# EAGLE design code-red (EAGLE 7.7.0)
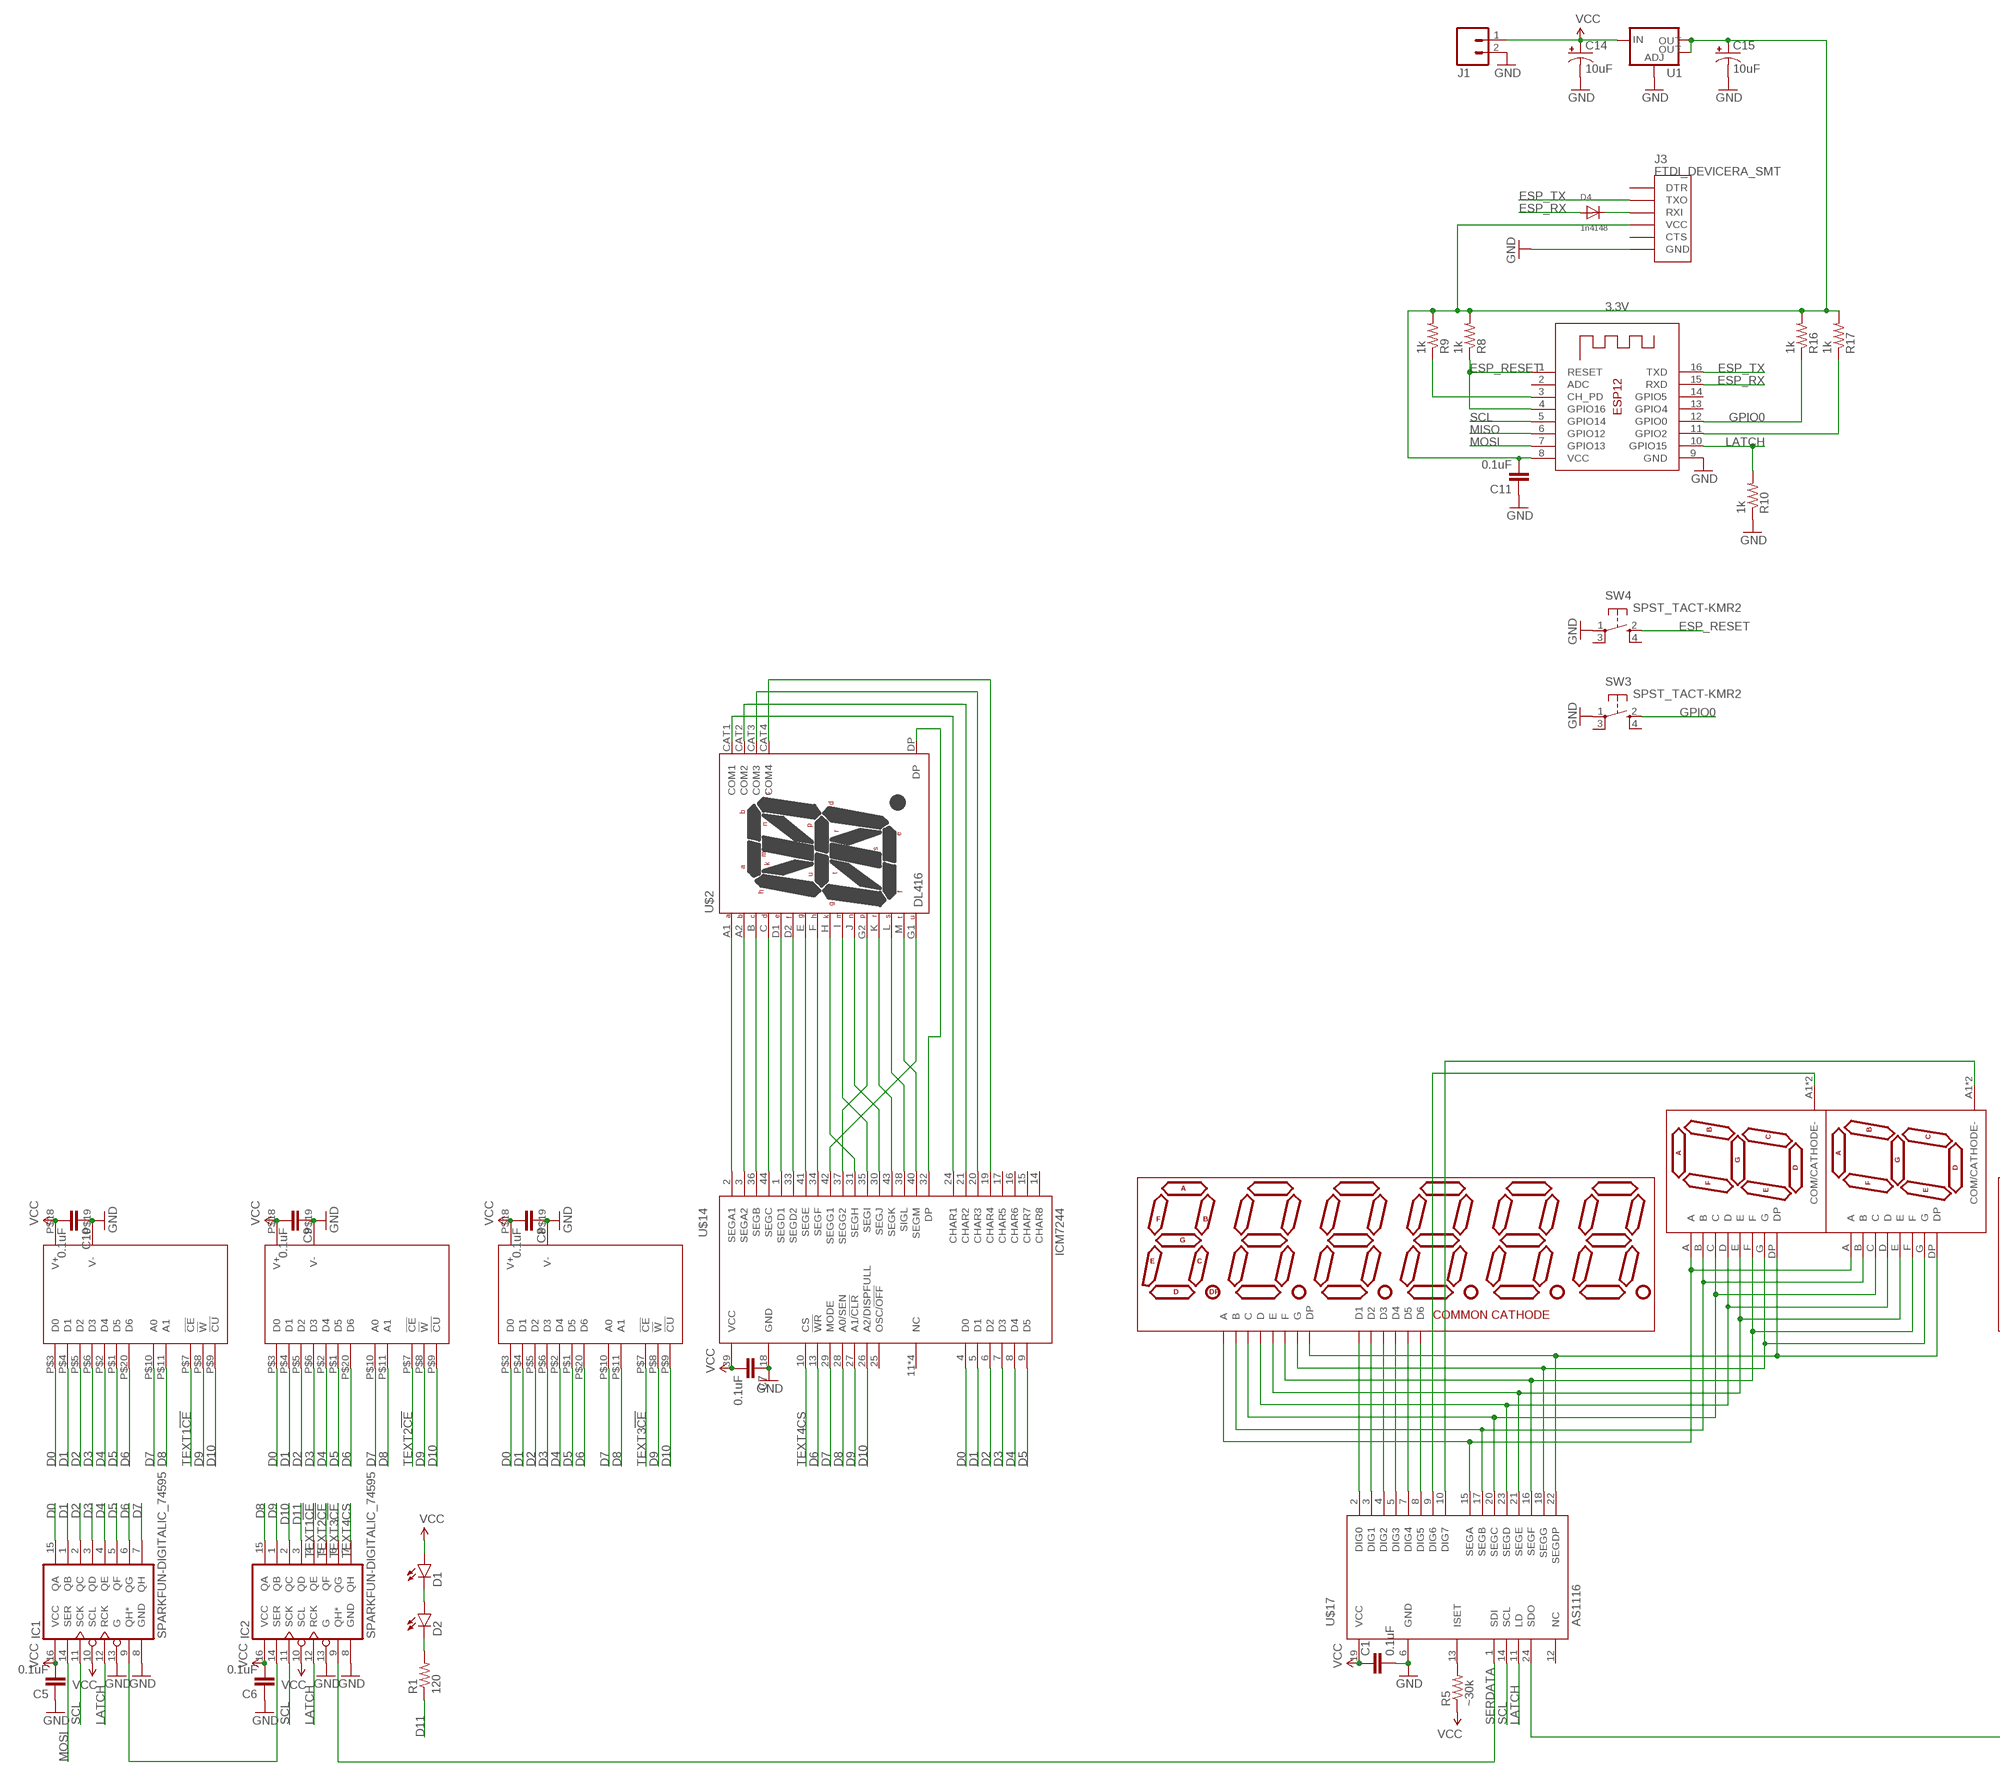
[diagram p0: schematic, sheet 1, part 1 of 2]
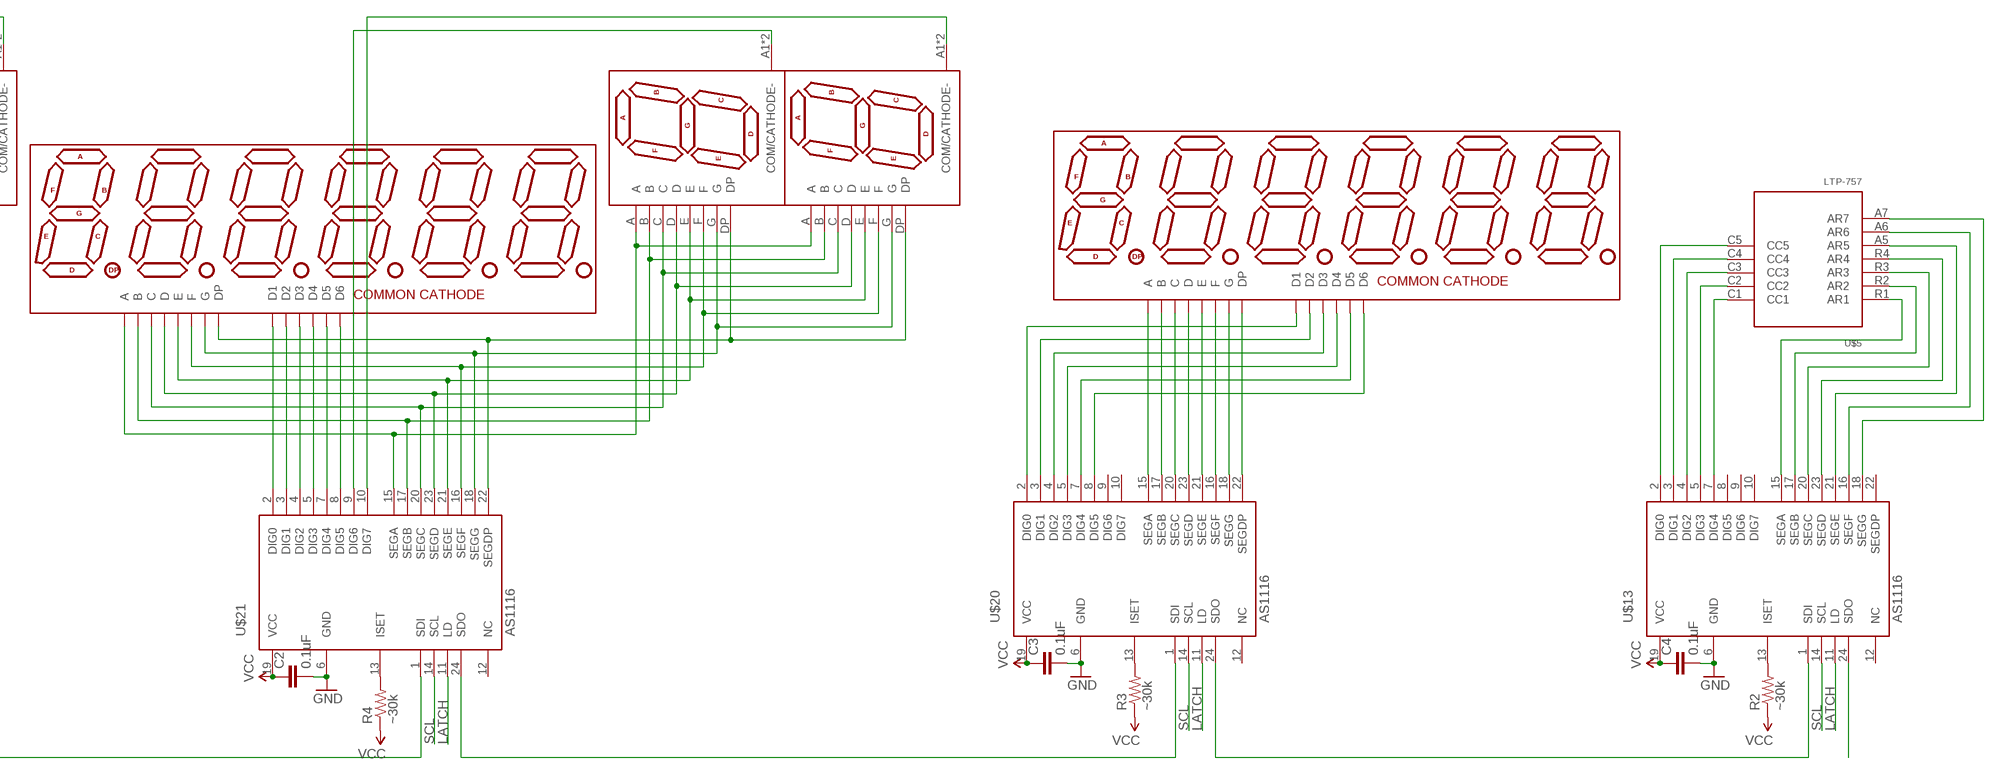
[diagram p1: schematic, sheet 1, part 2 of 2]

## Parts
C1  0.1uF  CAP0805  [0805]
C2  0.1uF  CAP0805  [0805]
C3  0.1uF  CAP0805  [0805]
C4  0.1uF  CAP0805  [0805]
C5  0.1uF  CAP0805  [0805]
C6  0.1uF  CAP0805  [0805]
C7  0.1uF  CAP0805  [0805]
C8  0.1uF  CAP0805  [0805]
C9  0.1uF  CAP0805  [0805]
C10  0.1uF  CAP0805  [0805]
C11  0.1uF  CAP0805  [0805]
C14  10uF  CAP_POLD  [PANASONIC_D]
C15  10uF  CAP_POLD  [PANASONIC_D]
D1  LED3MM  [LED3MM]
D2  LED3MM  [LED3MM]
D4  1n4148  DIODESOD-123  [SOD-123]
IC1  SPARKFUN-DIGITALIC_74595  [SPARKFUN-DIGITALIC_TSSOP16]
IC2  SPARKFUN-DIGITALIC_74595  [SPARKFUN-DIGITALIC_TSSOP16]
J1  M02LOCK_LONGPADS  [1X02_LOCK_LONGPADS]
J3  FTDI_DEVICERA_SMT  [FTDI_DEVICE_RA_SMT]
R1  120  RESISTOR0805-RES  [0805]
R2  ~30k  RESISTOR0805-RES  [0805]
R3  ~30k  RESISTOR0805-RES  [0805]
R4  ~30k  RESISTOR0805-RES  [0805]
R5  ~30k  RESISTOR0805-RES  [0805]
R8  1k  RESISTOR0805-RES  [0805]
R9  1k  RESISTOR0805-RES  [0805]
R10  1k  RESISTOR0805-RES  [0805]
R16  1k  RESISTOR0805-RES  [0805]
R17  1k  RESISTOR0805-RES  [0805]
SW3  SPST_TACT-KMR2  [KMR2]
SW4  SPST_TACT-KMR2  [KMR2]
U1  V_REG_LM1117SOT223  [SOT223]
U$1  DIS1291  [DIS1291]
U$2  DL416  [DL416]
U$3  DL1416T  [DL1416T]
U$4  FND259  [FND359]
U$5  LTP-757  [LTP-757]
U$6  DIS1291  [DIS1291]
U$7  DIS1291  [DIS1291]
U$8  DL1416T  [DL1416T]
U$9  DL1416T  [DL1416T]
U$10  FND259  [FND359]
U$11  FND259  [FND359]
U$12  FND259  [FND359]
U$13  AS1116  [SSOP24]
U$14  ICM7244  [MQFP44-2]
U$17  AS1116  [SSOP24]
U$20  AS1116  [SSOP24]
U$21  AS1116  [SSOP24]
X1  ESP-12  [ESP-12]

## Nets
3.3V: C11.2 C15.+ J3.4(VCC) R8.2 R9.2 R16.2 R17.2 U1.2(OUT) U1.4(OUT) X1.8(VCC)
D0: IC1.15(QA) U$3.P$3(D0) U$8.P$3(D0) U$9.P$3(D0) U$14.4(D0)
D1: IC1.1(QB) U$3.P$4(D1) U$8.P$4(D1) U$9.P$4(D1) U$14.5(D1)
D2: IC1.2(QC) U$3.P$5(D2) U$8.P$5(D2) U$9.P$5(D2) U$14.6(D2)
D3: IC1.3(QD) U$3.P$6(D3) U$8.P$6(D3) U$9.P$6(D3) U$14.7(D3)
D4: IC1.4(QE) U$3.P$2(D4) U$8.P$2(D4) U$9.P$2(D4) U$14.8(D4)
D5: IC1.5(QF) U$3.P$1(D5) U$8.P$1(D5) U$9.P$1(D5) U$14.9(D5)
D6: IC1.6(QG) U$3.P$20(D6) U$8.P$20(D6) U$9.P$20(D6) U$14.13(!WR)
D7: IC1.7(QH) U$3.P$10(A0) U$8.P$10(A0) U$9.P$10(A0) U$14.29(MODE)
D8: IC2.15(QA) U$3.P$11(A1) U$8.P$11(A1) U$9.P$11(A1) U$14.28(A0/SEN)
D9: IC2.1(QB) U$3.P$8(!W) U$8.P$8(!W) U$9.P$8(!W) U$14.27(A1/!CLR)
D10: IC2.2(QC) U$3.P$9(!CU) U$8.P$9(!CU) U$9.P$9(!CU) U$14.26(A2/DISPFULL)
D11: IC2.3(QD) R1.1
ESP_RESET: R8.1 SW4.2(S) X1.1(RESET) X1.4(GPIO16)
ESP_RX: D4.A X1.15(RXD)
ESP_TX: J3.2(TXO) X1.16(TXD)
GND: C1.2 C2.2 C3.2 C4.2 C5.1 C6.1 C7.1 C8.1 C9.1 C10.1 C11.1 C14.- C15.- IC1.8(GND) IC1.13(G) IC2.8(GND) IC2.13(G) J1.2 J3.6(GND) R10.1 SW3.1(P) SW4.1(P) U1.1(ADJ) U$3.P$19(V-) U$8.P$19(V-) U$9.P$19(V-) U$13.6(GND) U$14.18(GND) U$17.6(GND) U$20.6(GND) U$21.6(GND) X1.9(GND)
GPIO0: R16.1 SW3.2(S) X1.12(GPIO0)
LATCH: IC1.12(RCK) IC2.12(RCK) R10.2 U$13.11(LD) U$17.11(LD) U$20.11(LD) U$21.11(LD) X1.10(GPIO15)
MISO: X1.6(GPIO12)
MOSI: IC1.14(SER) X1.7(GPIO13)
N$1: U$1.P$12(A) U$4.A U$10.A U$17.15(SEGA)
N$2: U$1.P$16(F) U$4.F U$10.F U$17.16(SEGF)
N$3: U$1.P$15(B) U$4.B U$10.B U$17.17(SEGB)
N$4: U$1.P$9(G) U$4.G U$10.G U$17.18(SEGG)
N$5: U$1.P$1(C) U$4.C U$10.C U$17.20(SEGC)
N$6: U$1.P$7(E) U$4.E U$10.E U$17.21(SEGE)
N$7: U$1.P$8(DP) U$4.DP U$10.DP U$17.22(SEGDP)
N$8: U$1.P$4(D) U$4.D U$10.D U$17.23(SEGD)
N$9: U$1.P$14(D1) U$17.2(DIG0)
N$10: U$1.P$3(D2) U$17.3(DIG1)
N$11: U$1.P$13(D3) U$17.4(DIG2)
N$12: U$1.P$5(D4) U$17.5(DIG3)
N$13: U$1.P$11(D5) U$17.7(DIG4)
N$14: U$1.P$6(D6) U$17.8(DIG5)
N$15: U$6.P$12(A) U$11.A U$12.A U$21.15(SEGA)
N$16: U$6.P$16(F) U$11.F U$12.F U$21.16(SEGF)
N$17: U$6.P$15(B) U$11.B U$12.B U$21.17(SEGB)
N$18: U$6.P$9(G) U$11.G U$12.G U$21.18(SEGG)
N$19: U$6.P$1(C) U$11.C U$12.C U$21.20(SEGC)
N$20: U$6.P$7(E) U$11.E U$12.E U$21.21(SEGE)
N$21: U$6.P$8(DP) U$11.DP U$12.DP U$21.22(SEGDP)
N$22: U$6.P$4(D) U$11.D U$12.D U$21.23(SEGD)
N$23: U$6.P$14(D1) U$21.2(DIG0)
N$24: U$6.P$3(D2) U$21.3(DIG1)
N$25: U$6.P$13(D3) U$21.4(DIG2)
N$26: U$6.P$5(D4) U$21.5(DIG3)
N$27: U$6.P$11(D5) U$21.7(DIG4)
N$28: U$6.P$6(D6) U$21.8(DIG5)
N$29: U$7.P$12(A) U$20.15(SEGA)
N$30: U$7.P$16(F) U$20.16(SEGF)
N$31: U$7.P$15(B) U$20.17(SEGB)
N$32: U$7.P$9(G) U$20.18(SEGG)
N$33: U$7.P$1(C) U$20.20(SEGC)
N$34: U$7.P$7(E) U$20.21(SEGE)
N$35: U$7.P$8(DP) U$20.22(SEGDP)
N$36: U$7.P$4(D) U$20.23(SEGD)
N$37: U$7.P$14(D1) U$20.2(DIG0)
N$38: U$7.P$3(D2) U$20.3(DIG1)
N$39: U$7.P$13(D3) U$20.4(DIG2)
N$40: U$7.P$5(D4) U$20.5(DIG3)
N$41: U$7.P$11(D5) U$20.7(DIG4)
N$42: U$7.P$6(D6) U$20.8(DIG5)
N$43: U$2.G1(U) U$14.42(SEGG1)
N$44: R2.2 U$13.13(ISET)
N$45: R3.2 U$20.13(ISET)
N$46: R4.2 U$21.13(ISET)
N$47: R5.2 U$17.13(ISET)
N$48: IC1.9(QH*) IC2.14(SER)
N$49: U$2.CAT1(COM1) U$14.24(CHAR1)
N$51: U$13.1(SDI) U$20.24(SDO)
N$52: D1.K(C) D2.A
N$53: D2.K(C) R1.2
N$54: U$2.A1(A) U$14.2(SEGA1)
N$55: U$5.C1(CC1) U$13.7(DIG4)
N$56: U$5.C2(CC2) U$13.5(DIG3)
N$57: U$5.C3(CC3) U$13.4(DIG2)
N$58: U$5.C4(CC4) U$13.3(DIG1)
N$59: U$5.C5(CC5) U$13.2(DIG0)
N$60: U$5.R1(AR1) U$13.15(SEGA)
N$61: U$5.R2(AR2) U$13.17(SEGB)
N$62: U$5.R3(AR3) U$13.20(SEGC)
N$63: U$5.R4(AR4) U$13.23(SEGD)
N$64: U$5.A5(AR5) U$13.21(SEGE)
N$65: U$5.A6(AR6) U$13.16(SEGF)
N$66: U$5.A7(AR7) U$13.18(SEGG)
N$67: U$2.B(C1) U$14.36(SEGB)
N$68: U$2.C(D) U$14.44(SEGC)
N$69: U$20.1(SDI) U$21.24(SDO)
N$70: U$2.CAT2(COM2) U$14.21(CHAR2)
N$71: U$2.CAT3(COM3) U$14.20(CHAR3)
N$72: U$2.CAT4(COM4) U$14.19(CHAR4)
N$73: U$17.24(SDO) U$21.1(SDI)
N$75: U$13.24(SDO)
N$77: U$2.A2(B1) U$14.3(SEGA2)
N$78: U$2.D2(F1) U$14.33(SEGD2)
N$79: U$2.E(G) U$14.41(SEGE)
N$80: U$2.F(H1) U$14.34(SEGF)
N$81: U$2.H(K1) U$14.31(SEGH)
N$82: U$2.I(M1) U$14.35(SEGI)
N$83: U$2.J(N) U$14.30(SEGJ)
N$84: U$2.K(R) U$14.43(SEGK)
N$85: U$2.L(S) U$14.38(SIGL)
N$86: U$2.M(T) U$14.40(SEGM)
N$87: U$2.D1(E1) U$14.1(SEGD1)
N$88: U$2.DP U$14.32(DP)
N$89: U$2.G2(P) U$14.37(SEGG2)
N$90: U$4.A1(COM/CATHODE-) U$4.A2(COM/CATHODE-) U$17.9(DIG6)
N$91: U$10.A1(COM/CATHODE-) U$10.A2(COM/CATHODE-) U$17.10(DIG7)
N$92: U$11.A1(COM/CATHODE-) U$11.A2(COM/CATHODE-) U$21.9(DIG6)
N$93: U$12.A1(COM/CATHODE-) U$12.A2(COM/CATHODE-) U$21.10(DIG7)
N$94: R9.1 X1.3(CH_PD)
N$98: D4.C J3.3(RXI)
N$99: R17.1 X1.11(GPIO2)
SCL: IC1.11(SCK) IC2.11(SCK) U$13.14(SCL) U$17.14(SCL) U$20.14(SCL) U$21.14(SCL) X1.5(GPIO14)
SERDATA: IC2.9(QH*) U$17.1(SDI)
TEXT1!CE: IC2.4(QE) U$3.P$7(!CE)
TEXT2!CE: IC2.5(QF) U$8.P$7(!CE)
TEXT3!CE: IC2.6(QG) U$9.P$7(!CE)
TEXT4CS: IC2.7(QH) U$14.10(CS)
VCC: C1.1 C2.1 C3.1 C4.1 C5.2 C6.2 C7.2 C8.2 C9.2 C10.2 C14.+ D1.A IC1.10(SCL) IC1.16(VCC) IC2.10(SCL) IC2.16(VCC) J1.1 R2.1 R3.1 R4.1 R5.1 U1.3(IN) U$3.P$18(V+) U$8.P$18(V+) U$9.P$18(V+) U$13.19(VCC) U$14.39(VCC) U$17.19(VCC) U$20.19(VCC) U$21.19(VCC)
Unconnected: J3.1(DTR) J3.5(CTS) SW3.3(P1) SW3.4(S1) SW4.3(P1) SW4.4(S1) U$13.8(DIG5) U$13.9(DIG6) U$13.10(DIG7) U$13.12(NC) U$13.22(SEGDP) U$14.11(NC) U$14.12(NC) U$14.14(CHAR8) U$14.15(CHAR7) U$14.16(CHAR6) U$14.17(CHAR5) U$14.22(NC) U$14.23(NC) U$14.25(OSC/!OFF) U$17.12(NC) U$20.9(DIG6) U$20.10(DIG7) U$20.12(NC) U$21.12(NC) X1.2(ADC) X1.13(GPIO4) X1.14(GPIO5)

## Library data of the parts
C1-C11 = SparkFun-Capacitors:CAP: Capacitor Standard 0603 ceramic capacitor, and 0.1" leaded capacitor.
C14 C15 = SparkFun-Capacitors:CAP_POL: Capacitor Polarized These are standard SMD and PTH capacitors. Normally 10uF, 47uF, and 100uF in electrolytic and tantalum varieties. Always verify the external diameter of the through hole cap, it varies with capacity, voltage, and manufacturer. The EIA devices should be standard.
D1 D2 = SparkFun-LED:LED: LEDs Standard schematic elements and footprints for 5mm, 3mm, 1206, and 0603 sized LEDs. 5mm - Spark Fun Electronics SKU : COM-00529 (and others); PROD_ID: DIO-08794
D4 = adafruit:DIODE: Diode SMADIODE - SMA Surface Mount Package 20V 1A Schottky Diode Digikey: 641-1014-6-ND DO-1N4148 - Through Hole Small Current Diode SOD-123 20V 1 A (.5mV Vf) Schottky Diode - Digikey: MBRX120TPMSCT-ND SOD-323 10V 570mA (.38mV Vf, 3ns) Schottky Diode - Digikey: ZLLS410CT-ND SOD-523 30V 30mA Schottky Diode (RB751S-40TE61) - Digikey: RB751S-40TE61CT-ND SOT23-R/W - SOT23 Package (R = Solder Paste/Reflow Ovens, W = Hand-Soldering) BAT54Film 40V 300mA - Digikey: 497-7162-1-ND
IC1 IC2 = TimeCircuits:SPARKFUN-DIGITALIC_74*595: 8-bit SHIFT REGISTER, output latch
J1 = SparkFun-Connectors:M02: Standard 2-pin 0.1" header. Use with - straight break away headers ( PRT-00116) - right angle break away headers (PRT-00553) - swiss pins (PRT-00743) - machine pins (PRT-00117) - female headers (PRT-00115) Molex polarized connector foot print use with: PRT-08233 with associated crimp pins and housings. 2.54_SCREWTERM for use with PRT-10571. 3.5mm Screw Terminal footprints for PRT-08084 5mm Screw Terminal footprints for use with PRT-08432
J3 = SparkFun-Connectors:FTDI_DEVICE: Connector which mates to FTDI basic or FTDI cable.; PROD_ID: CONN-08971
R1-R5 R8-R10 R16 R17 = SparkFun-Resistors:RESISTOR: Resistor Basic schematic elements and footprints for 0603, 1206, and PTH resistors.
SW3 SW4 = adafruit:SPST_TACT: SMT 6mm switch, EVQQ2 series http://www.ladyada.net/library/eagle
U1 = SparkFun-PowerIC:V_REG_LM1117: Voltage Regulator LM1117 Standard adjustable voltage regulator but in SMD form. Spark Fun Electronics SKU : COM-00595; PROD_ID: VREG-08170
U$1 U$6 U$7 = sonik:DIS1291
U$2 = sonik:DL416
U$3 U$8 U$9 = sonik:DL1416T
U$4 U$10-U$12 = sonik:FND259
U$5 = sonik:LTP-757
U$13 U$17 U$20 U$21 = sonik:AS1116
U$14 = sonik:ICM7244
X1 = adafruit:ESP-12

## Net classes
2 power: width 0.203 mm

## Board
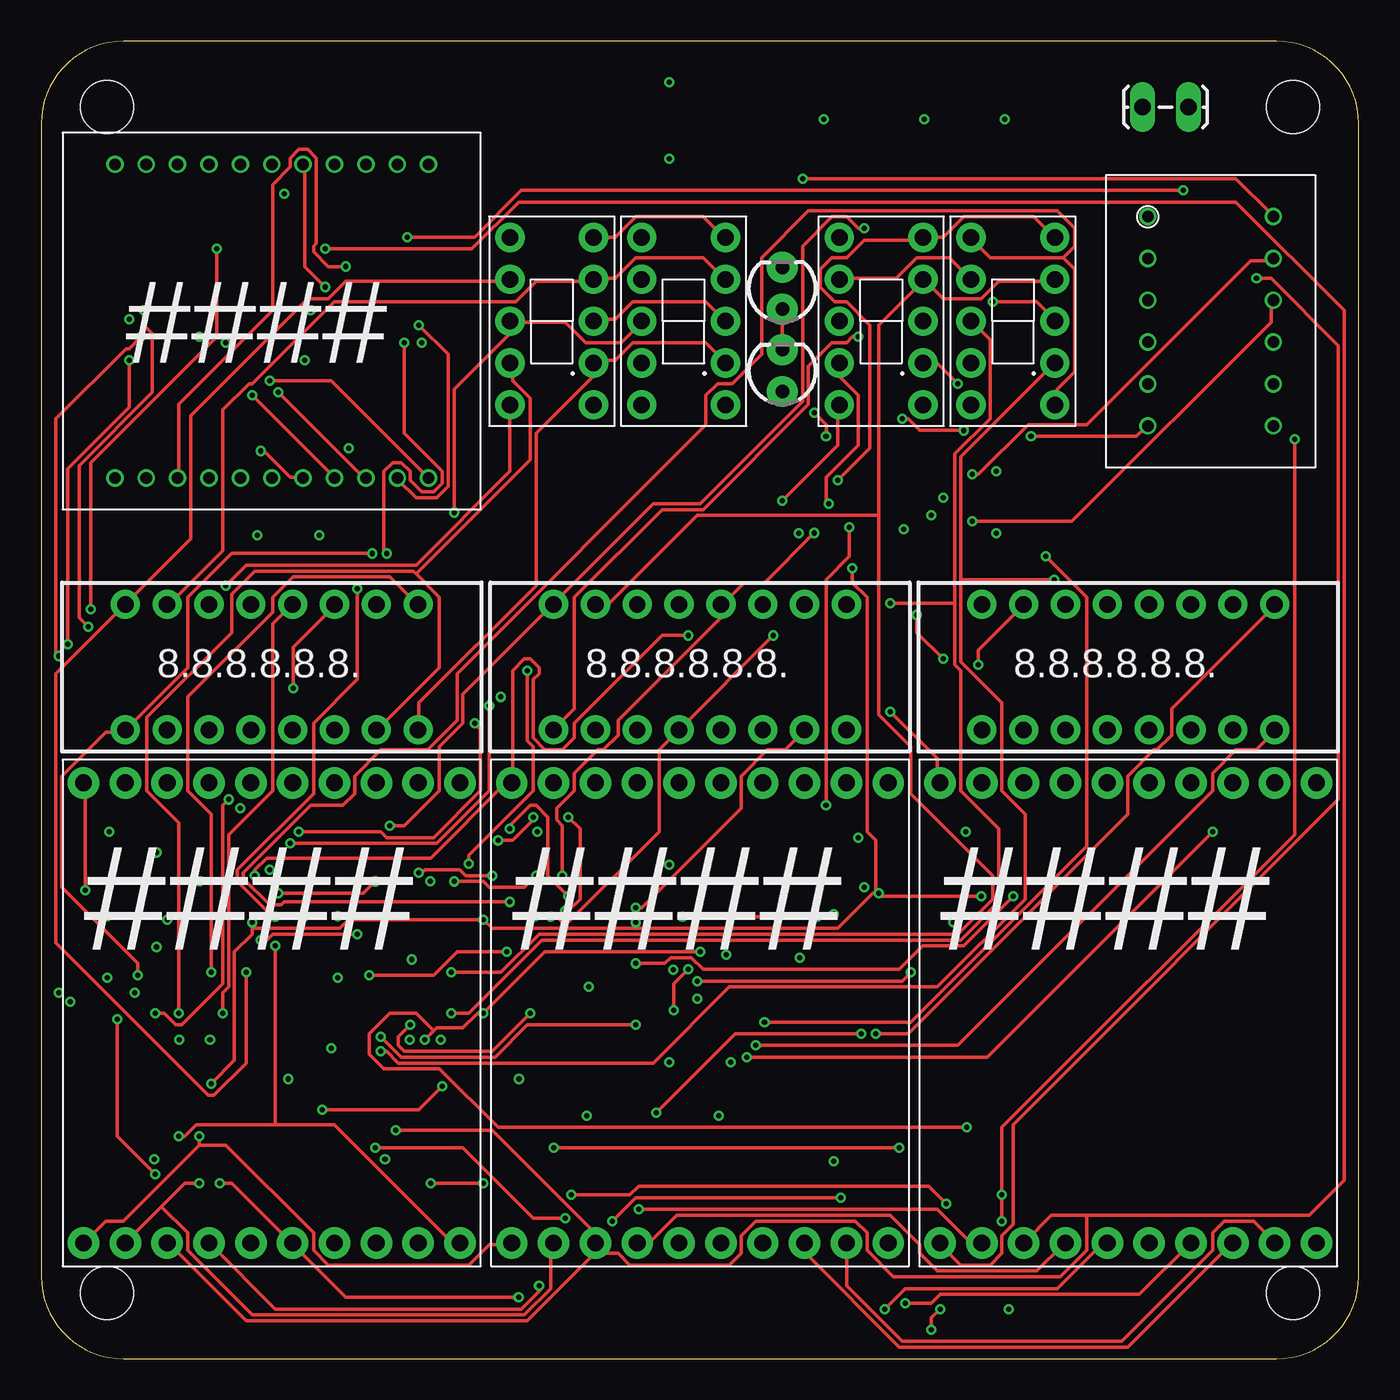
[diagram p2: board, top side]
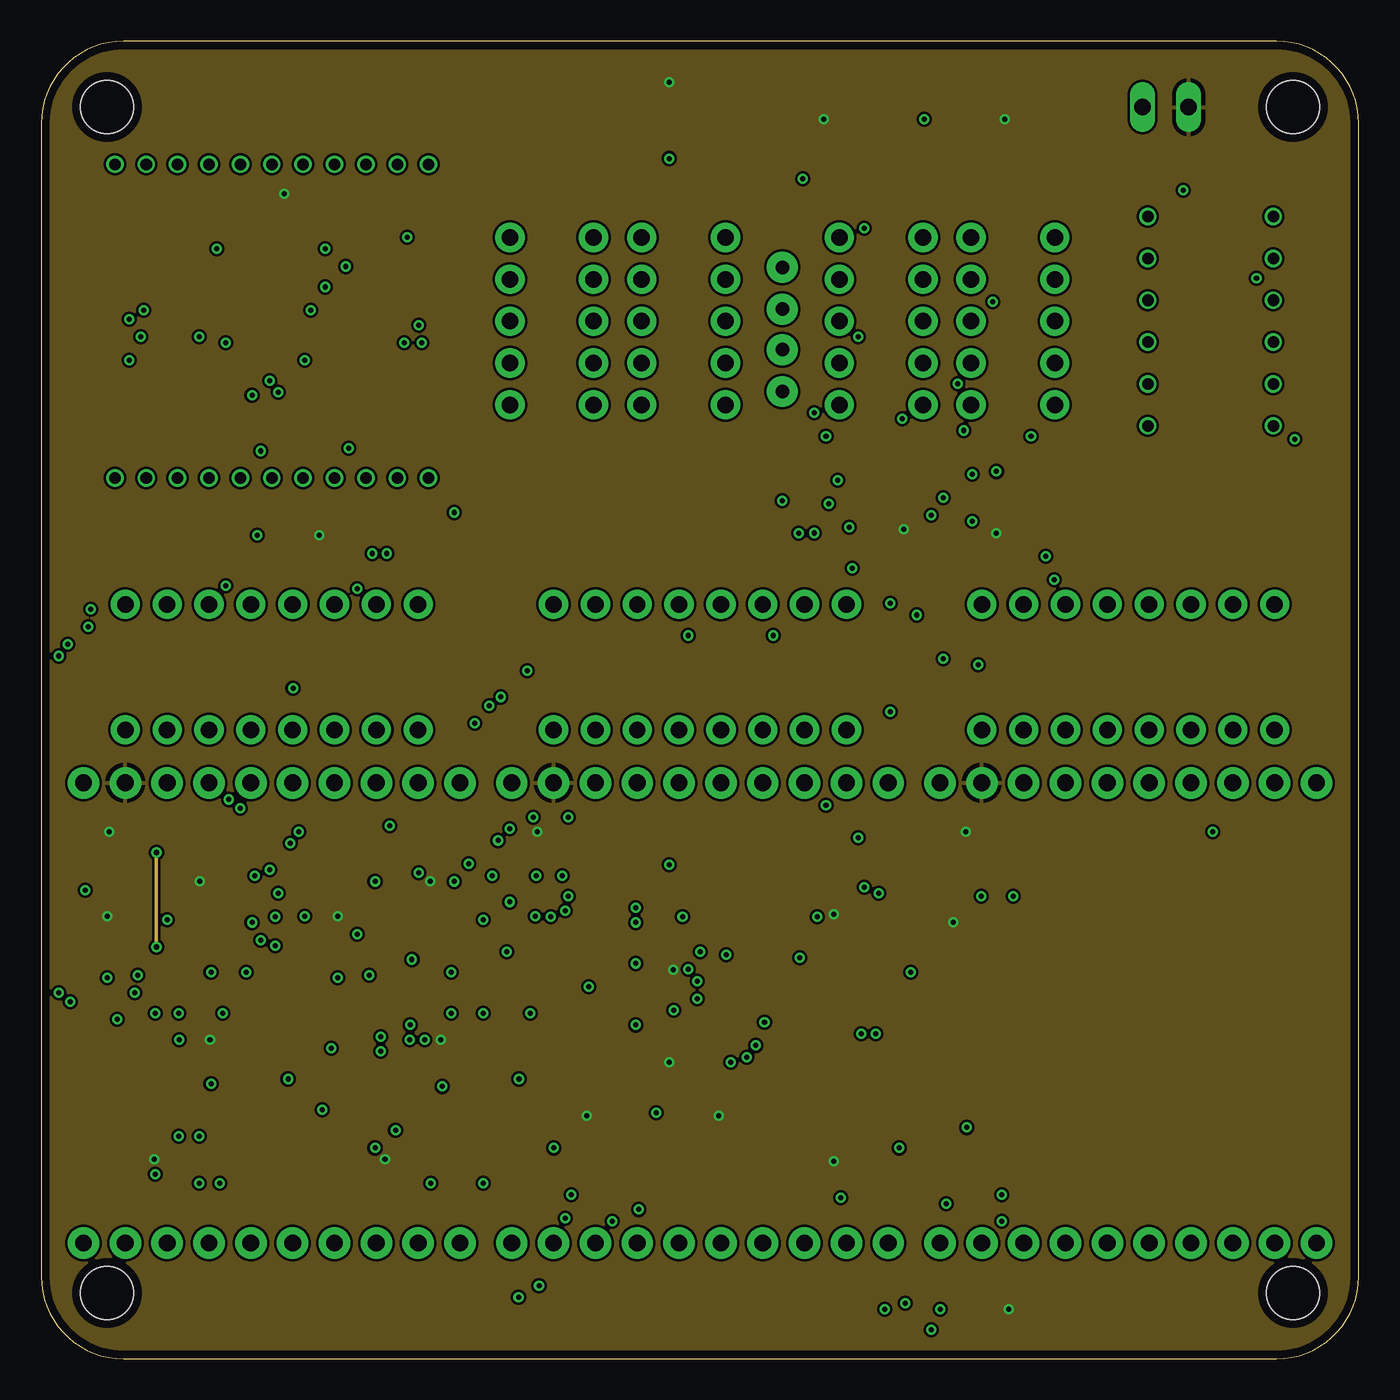
[diagram p3: board, inner layer Route2]
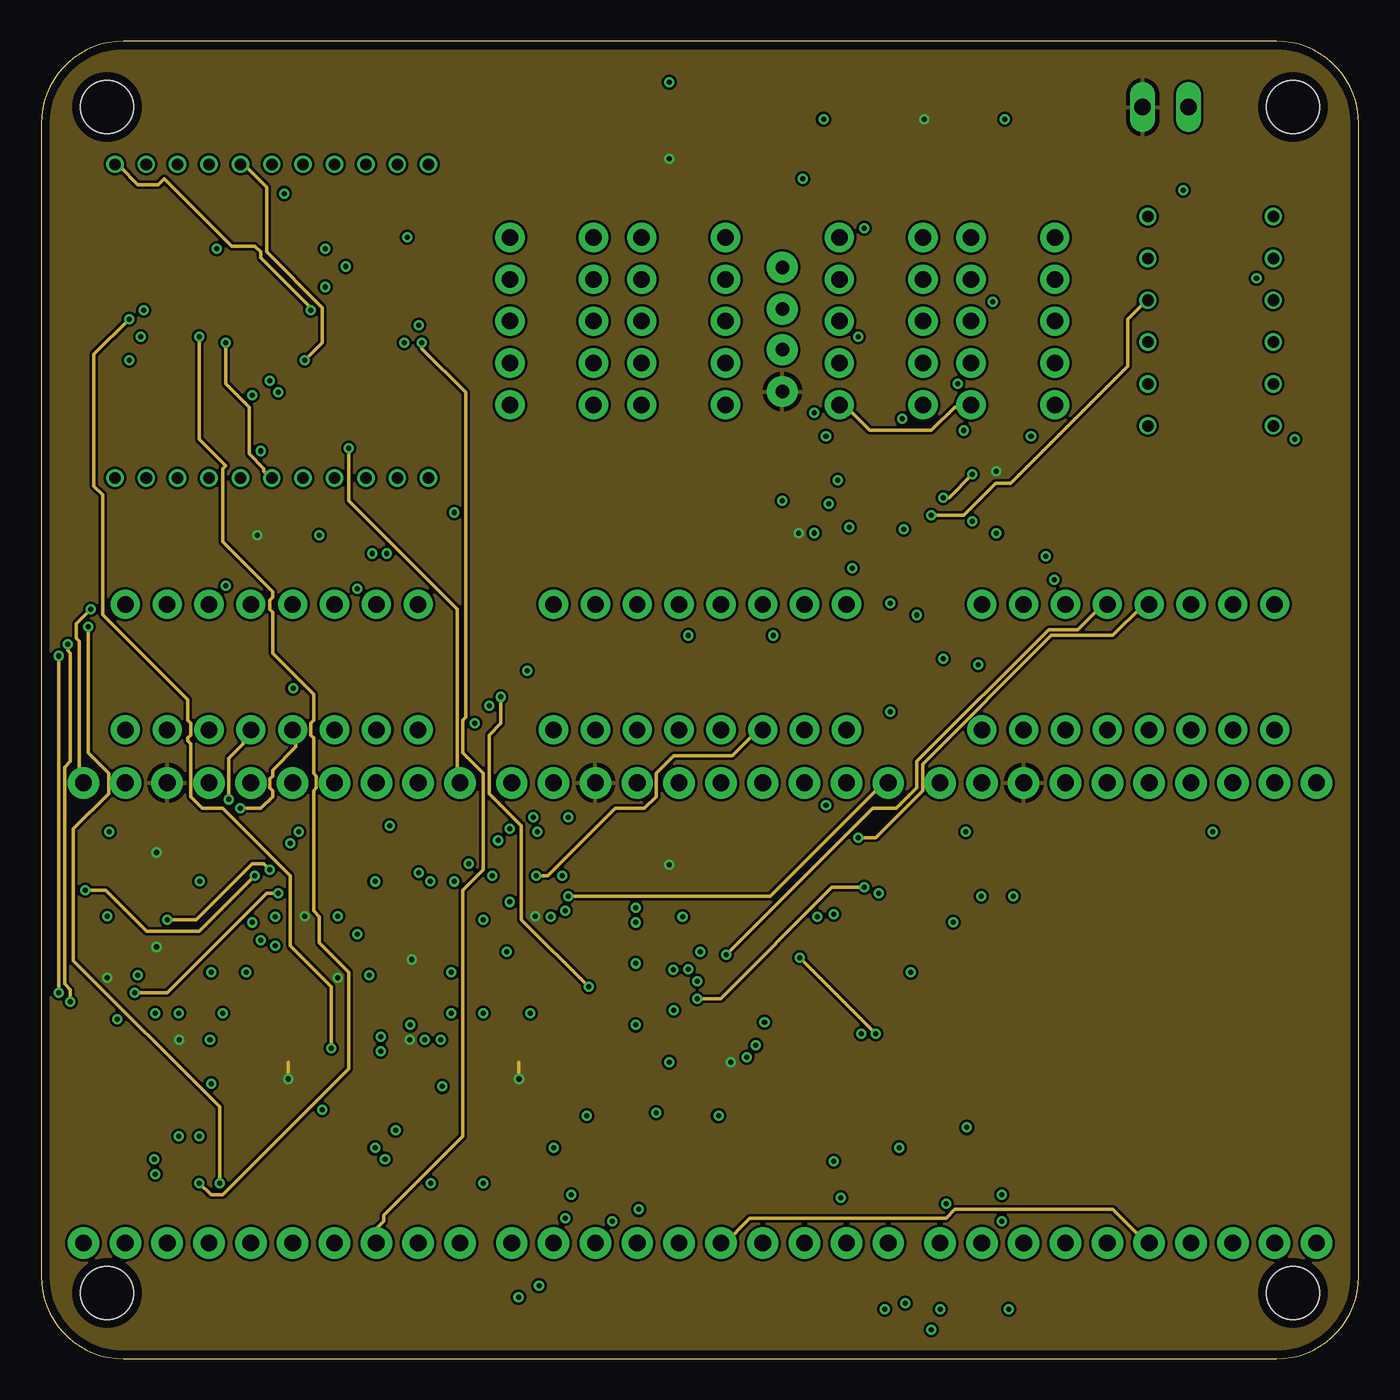
[diagram p4: board, inner layer Route15]
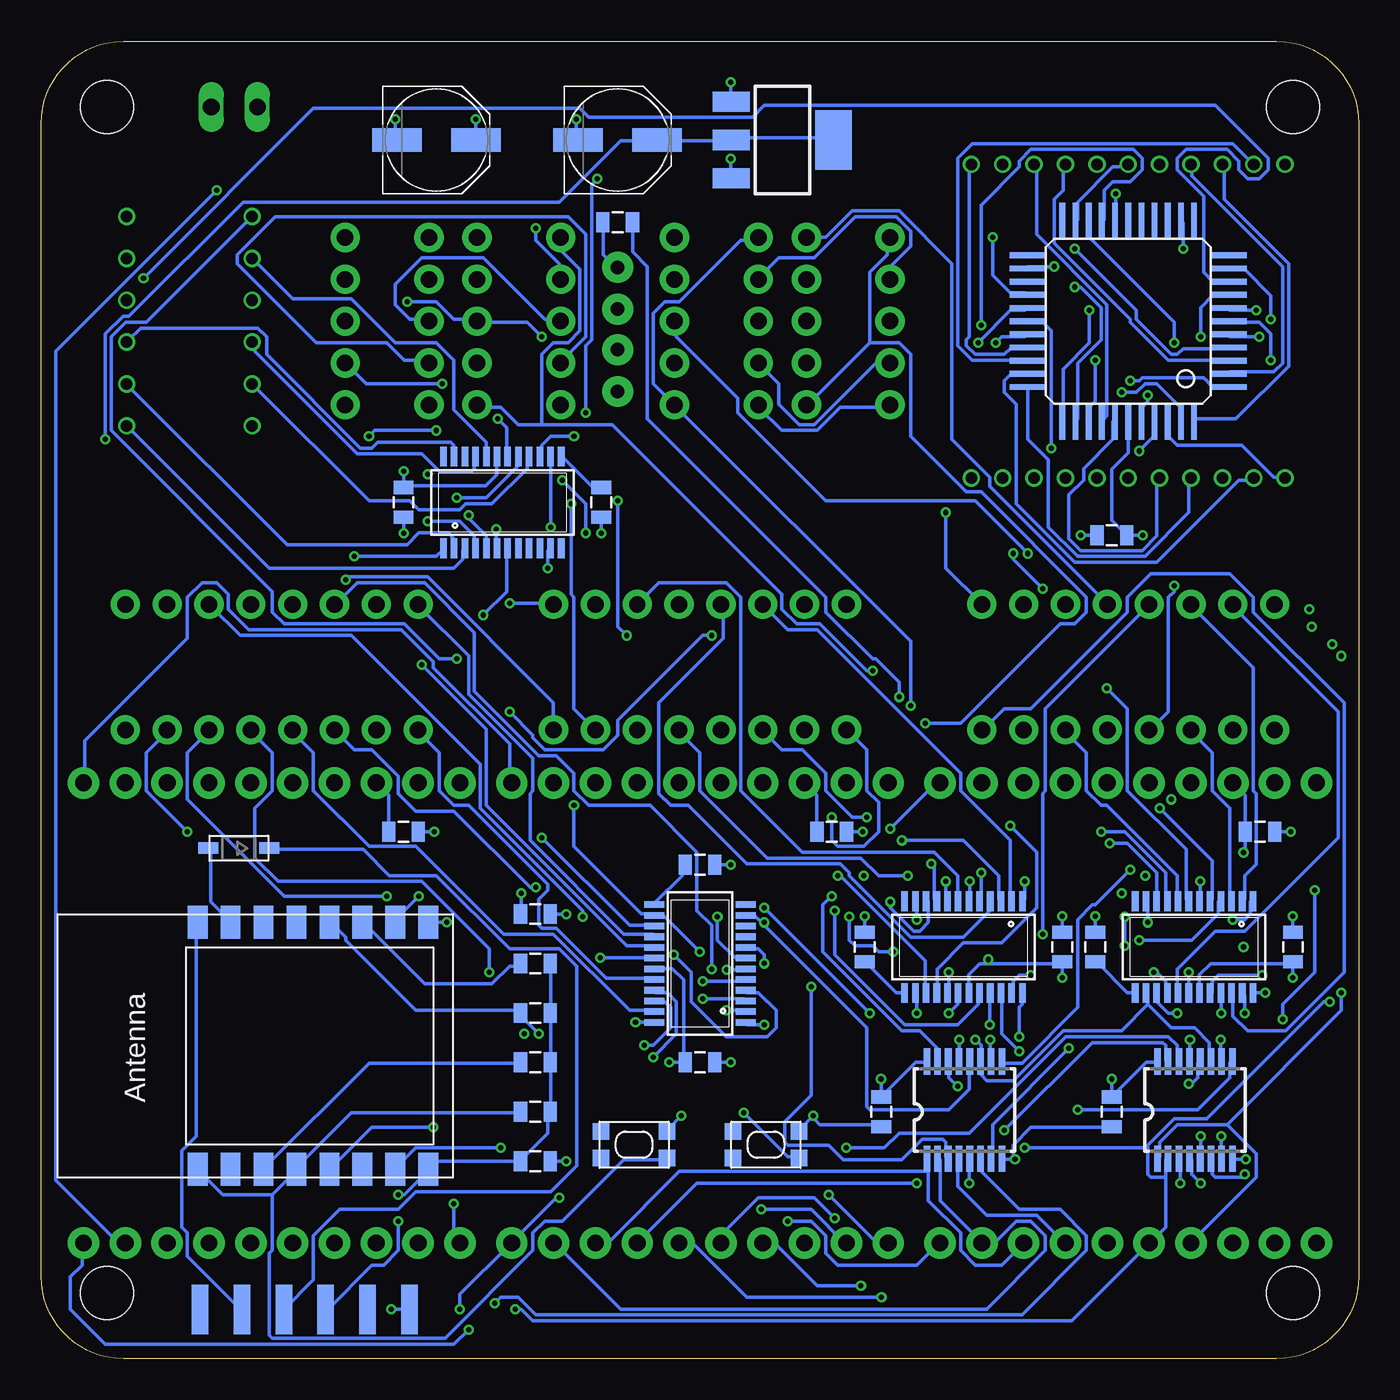
[diagram p5: board, bottom side, seen from below]

Size 80 x 80 mm. Coordinates in mm from the lower left corner, seen from the top.
Outline: 0,75 0,5 arc90 5,0 75,0 arc90 80,5 80,75 arc90 75,80 5,80 arc90 0,75
Copper layers (1*2*15*16): Top 0.035mm / dielectric 0.23mm / Route2 0.035mm / dielectric 0.93mm / Route15 0.035mm / dielectric 0.23mm / Bottom 0.035mm
Design rules "MF_Standard_4_Layer *": minimum track width 8mil, minimum drill 12mil, track to track 6mil, track to pad 6mil, pad to pad 6mil, via to via 8mil, smd to smd 0mil, copper to edge 20mil, drill to drill 10mil, minimum pad ring 6mil, minimum via ring 6mil, stop-mask expansion 2mil, vias tented up to drill 25mil, thermal gap 10mil
Holes 3.2 mm at 4,4 76,4 76,76 4,76

### Footprints (pad centres in the part's own frame; a part is rotated, then mirrored left to right if it is on the bottom)
0805 = smd 0.8 x 1.2: 1 -0.9,0; 2 0.9,0
PANASONIC_D = smd 3 x 1.4: + 2.4,0; - -2.4,0
LED3MM = drill 0.813 pad 1.88: A -1.27,0; K 1.27,0
SOD-123 = smd 1.2 x 0.7: A 1.85,0; C -1.85,0
SPARKFUN-DIGITALIC_TSSOP16 = smd 0.4 x 1.6: 1 -2.225,-2.85; 2 -1.575,-2.85; 3 -0.925,-2.85; 4 -0.275,-2.85; 5 0.375,-2.85; 6 1.025,-2.85; 7 1.675,-2.85; 8 2.325,-2.85; 9 2.325,3.05; 10 1.675,3.05; 11 1.025,3.05; 12 0.375,3.05; 13 -0.275,3.05; 14 -0.925,3.05; 15 -1.575,3.05; 16 -2.225,3.05
1X02_LOCK_LONGPADS = drill 1.016 long: 1 -0.127,0; 2 2.667,0
FTDI_DEVICE_RA_SMT = smd 1 x 3: 1 -6.35,5; 2 -3.81,5; 3 -1.27,5; 4 1.27,5; 5 3.81,5; 6 6.35,5
KMR2 = smd 1 x 1: 1 2,0.8; 2 2,-0.8; 3 -2,0.8; 4 -2,-0.8
SOT223 = smd 1.219 x 2.235: 1 -2.311,-3.099; 2 0,-3.099; 3 2.311,-3.099 | smd 3.6 x 2.2: 4 0,3.099
DIS1291 = drill 1 pad 1.778: P$1 -8.89,-3.81; P$2 -6.35,-3.81; P$3 -3.81,-3.81; P$4 -1.27,-3.81; P$5 1.27,-3.81; P$6 3.81,-3.81; P$7 6.35,-3.81; P$8 8.89,-3.81; P$9 8.89,3.81; P$10 6.35,3.81; P$11 3.81,3.81; P$12 1.27,3.81; P$13 -1.27,3.81; P$14 -3.81,3.81; P$15 -6.35,3.81; P$16 -8.89,3.81
DL416 = drill 0.7: A1 -3.81,9.525; A2 3.81,9.525; B -1.905,9.525; C -5.715,9.525; CAT1 -5.715,-9.525; CAT2 0,9.525; CAT3 0,-9.525; CAT4 7.62,-9.525; D1 9.525,-9.525; D2 -3.81,-9.525; DP -7.62,-9.525; E 1.905,-9.525; F -9.525,9.525; G1 -9.525,-9.525; G2 5.715,9.525; H -7.62,9.525; I 1.905,9.525; J 9.525,9.525; K 5.715,-9.525; L -1.905,-9.525; M 3.81,-9.525; NC 7.62,9.525
DL1416T = drill 1.016 pad 1.905: P$1 -11.43,-13.97; P$2 -8.89,-13.97; P$3 -6.35,-13.97; P$4 -3.81,-13.97; P$5 -1.27,-13.97; P$6 1.27,-13.97; P$7 3.81,-13.97; P$8 6.35,-13.97; P$9 8.89,-13.97; P$10 11.43,-13.97; P$11 11.43,13.97; P$12 8.89,13.97; P$13 6.35,13.97; P$14 3.81,13.97; P$15 1.27,13.97; P$16 -1.27,13.97; P$17 -3.81,13.97; P$18 -6.35,13.97; P$19 -8.89,13.97; P$20 -11.43,13.97
FND359 = drill 1 pad 1.778: A 2.54,5.08; A1 -2.54,5.08; A2 2.54,-5.08; B 2.54,2.54; C 2.54,0; D -2.54,-5.08; DP 2.54,-2.54; E -2.54,-2.54; F -2.54,2.54; G -2.54,0
LTP-757 = drill 0.7: A5 -3.81,-1.27; A6 -3.81,-3.81; A7 -3.81,-6.35; C1 -3.81,6.35; C2 -3.81,1.27; C3 3.81,1.27; C4 3.81,-6.35; C5 3.81,-3.81; R1 3.81,6.35; R2 3.81,3.81; R3 -3.81,3.81; R4 3.81,-1.27
SSOP24 = smd 0.4 x 1.2: 1 -3.575,-2.785; 2 -2.925,-2.785; 3 -2.275,-2.785; 4 -1.625,-2.785; 5 -0.975,-2.785; 6 -0.325,-2.785; 7 0.325,-2.785; 8 0.975,-2.785; 9 1.625,-2.785; 10 2.275,-2.785; 11 2.925,-2.785; 12 3.575,-2.785; 13 3.575,2.785; 14 2.925,2.785; 15 2.275,2.785; 16 1.625,2.785; 17 0.975,2.785; 18 0.325,2.785; 19 -0.325,2.785; 20 -0.975,2.785; 21 -1.625,2.785; 22 -2.275,2.785; 23 -2.925,2.785; 24 -3.575,2.785
MQFP44-2 = smd 0.35 x 2.2: 1 -4,-6.1; 2 -3.2,-6.1; 3 -2.4,-6.1; 4 -1.6,-6.1; 5 -0.8,-6.1; 6 0,-6.1; 7 0.8,-6.1; 8 1.6,-6.1; 9 2.4,-6.1; 10 3.2,-6.1; 11 4,-6.1; 23 4,6.1; 24 3.2,6.1; 25 2.4,6.1; 26 1.6,6.1; 27 0.8,6.1; 28 0,6.1; 29 -0.8,6.1; 30 -1.6,6.1; 31 -2.4,6.1; 32 -3.2,6.1; 33 -4,6.1 | smd 2.2 x 0.35: 12 6.1,-4; 13 6.1,-3.2; 14 6.1,-2.4; 15 6.1,-1.6; 16 6.1,-0.8; 17 6.1,0; 18 6.1,0.8; 19 6.1,1.6; 20 6.1,2.4; 21 6.1,3.2; 22 6.1,4; 34 -6.1,4; 35 -6.1,3.2; 36 -6.1,2.4; 37 -6.1,1.6; 38 -6.1,0.8; 39 -6.1,0; 40 -6.1,-0.8; 41 -6.1,-1.6; 42 -6.1,-2.4; 43 -6.1,-3.2; 44 -6.1,-4
ESP-12 = smd 2 x 1.2: 1 -7.5,4.5; 2 -7.5,2.5; 3 -7.5,0.5; 4 -7.5,-1.5; 5 -7.5,-3.5; 6 -7.5,-5.5; 7 -7.5,-7.5; 8 -7.5,-9.5; 9 7.5,-9.5; 10 7.5,-7.5; 11 7.5,-5.5; 12 7.5,-3.5; 13 7.5,-1.5; 14 7.5,0.5; 15 7.5,2.5; 16 7.5,4.5

### Placement (x,y rotation side)
C1  4,25 90 bottom
C2  18,25 90 bottom
C3  40,18 0 bottom
C4  29,15 270 bottom
C5  15,15 90 bottom
C6  58,52 90 bottom
C7  15,50 0 bottom
C8  6,32 180 bottom
C9  32,32 180 bottom
C10  58,32 180 bottom
C11  50,12 180 bottom
C14  56,74 0 bottom
C15  45,74 0 bottom
D1  45,60 90 top
D2  45,65 90 top
D4  68,31 180 bottom
IC1  10,15 0 bottom
IC2  24,15 0 bottom
J1  67,76 0 top
J3  64,-2 0 bottom
R1  45,69 180 bottom
R2  46,52 90 bottom
R3  40,30 180 bottom
R4  30,25 270 bottom
R5  16,25 270 bottom
R8  50,15 0 bottom
R9  50,18 0 bottom
R10  50,27 180 bottom
R16  50,21 0 bottom
R17  50,24 0 bottom
SW3  36,13 0 bottom
SW4  44,13 0 bottom
U1  35,74 270 bottom
U$1  14,42 0 top
U$2  14,63 0 top
U$3  14,21 0 top
U$4  31,63 0 top
U$5  71,63 0 top
U$6  40,42 0 top
U$7  66,42 0 top
U$8  40,21 0 top
U$9  66,21 0 top
U$10  39,63 0 top
U$11  51,63 0 top
U$12  59,63 0 top
U$13  52,52 0 bottom
U$14  14,63 90 bottom
U$17  10,25 180 bottom
U$20  40,24 90 bottom
U$21  24,25 180 bottom
X1  66,19 90 bottom

### Tracks (layer width: path | path; a pad name or v marks a point on that pad's centre or on a via)
3.3V  (via drill 0.3)
  Top 0.203: v58.32,8.36 v58.32,9.96 58.32,14.05 76.1,31.83 v76.1,55.83
  Bottom 0.203: U1.4 32,74.14 38.05,74.14 U1.2 38.23,73.97 42.49,73.97 C15.+ 42.67,73.97 44.81,73.97 48.54,70.23 67.74,70.23 74.68,63.3 75.03,63.3 76.1,62.23 v76.1,55.83 | R17.2 49.07,23.82 49.07,21.16 R16.2 49.07,20.98 49.07,18.14 R9.2 49.07,17.96 49.07,15.11 R8.2 49.25,14.94 49.25,13.69 50.85,12.09 C11.2 56,12 X1.8 56.54,11.38 57.96,9.96 v58.32,9.96 | v58.32,8.36 58.32,6.58 59.21,5.69 59.92,5.69 62.59,3.02 J3.4
D0  (via drill 0.3)
  Top 0.203: v21.51,13.87 27.38,13.87 33.6,7.64 33.6,7.11 U$8.P$3 | 33.6,6.4 29.52,2.31 12.45,2.31 7.82,6.93 U$3.P$3 | 33.6,6.4 33.6,6.93 U$8.P$3 | v17.25,67.39 26.14,67.39 28.98,70.23 72.54,70.23 79.12,63.65 79.12,10.85 76.99,8.71 63.48,8.71 | 63.48,8.71 61.34,8.71 59.74,7.11 U$9.P$3 | 33.6,6.4 35.03,6.4 35.74,5.69 41.78,5.69 42.49,6.4 42.49,7.47 43.38,8.36 49.43,8.36 50.14,7.64 50.14,6.58 51.74,4.98 61.87,4.98 63.48,6.58 63.48,8.71 | 33.6,6.4 U$8.P$3
  Bottom 0.203: v21.51,13.87 16.18,19.2 11.91,19.2 11.73,19.02 11.73,18.14 IC1.15 | v17.25,67.39 13.51,63.65 13.51,63.12 11.38,60.98 11.02,60.98 10.67,61.34 8,61.34 U$14.4
D1  (via drill 0.3)
  Top 0.203: U$8.P$4 36.27,7.11 36.98,7.11 38.58,8.71 51.56,8.71 53.34,6.93 53.34,6.4 54.41,5.33 60.45,5.33 62.05,6.93 U$9.P$4 | v6.04,62.05 5.33,61.34 5.16,61.34 0.89,57.07 0.89,42.85 v1.07,42.67 | v30.23,4.45 30.23,4.09 29.16,3.02 14.22,3.02 10.31,6.93 U$3.P$4
  Route15 0.203: v1.07,22.23 v1.07,42.67
  Bottom 0.203: 8,14.22 11.02,14.22 12.09,13.16 12.09,12.27 IC1.1 | 8,14.22 6.22,12.45 6.22,11.02 10.13,7.11 U$3.P$4 | v6.04,62.05 7.82,62.05 U$14.5 | v1.07,22.23 1.07,21.16 8,14.22 | v30.23,4.45 32.89,4.45 35.38,6.93 36.09,6.93 U$8.P$4
D2  (via drill 0.3)
  Top 0.203: v5.33,60.63 5.33,57.78 1.6,54.05 v1.6,43.38 | v31.83,8.53 29.87,8.53 25.6,12.8 v20.27,12.8 | v51.21,3.02 52.45,4.27 61.7,4.27 64.36,6.93 64.72,6.93 U$9.P$5
  Route15 0.203: v1.6,43.38 1.6,43.03 1.78,42.85 1.78,36.27 1.42,35.92 1.42,22.76 1.78,22.4 v1.78,21.69
  Bottom 0.203: 11.73,11.02 11.73,8 12.62,7.11 U$3.P$5 12.8,6.93 17.42,2.31 50.14,2.31 50.85,3.02 v51.21,3.02 | 11.73,11.02 11.73,12.09 IC1.2 | v5.33,60.63 5.33,62.23 6.04,62.94 7.82,62.94 U$14.6 | v1.78,21.69 2.13,21.69 9.25,14.58 11.2,14.58 12.8,12.98 12.8,12.8 | 12.8,12.8 12.8,11.2 12.62,11.02 11.73,11.02 | v31.83,8.53 33.07,9.78 36.45,9.78 38.58,7.64 38.58,7.11 U$8.P$5 | 12.8,12.8 v20.27,12.8
D3  (via drill 0.3)
  Top 0.203: v10.85,10.67 11.56,10.67 15.11,7.11 U$3.P$6 15.29,6.93 18.49,3.73 v28.98,3.73 | v6.22,63.65 6.22,62.76 6.76,62.23 6.76,58.67 2.31,54.23 2.31,44.98 v2.85,44.45
  Route15 0.203: v2.85,44.45 2.85,36.8 4.09,35.56 4.09,34.31 1.96,32.18 1.96,24.18 10.85,15.29 v10.85,10.67 | U$9.P$6 67.21,7.11 66.85,7.47 66.67,7.47 65.08,9.07 55.47,9.07 54.94,8.53 43.03,8.53 41.43,6.93 U$8.P$6
  Bottom 0.203: v10.85,10.67 10.85,12.09 IC1.3 | v6.22,63.65 7.82,63.65 U$14.7 | v28.98,3.73 37.16,3.73 40.36,6.93 41.25,6.93 U$8.P$6
D4  (via drill 0.3)
  Top 0.203: v9.6,10.67 8.71,10.67 7.29,9.25 | 7.29,9.25 5.16,7.11 U$3.P$2 | 7.29,9.25 8.89,7.64 8.89,6.58 12.8,2.67 29.34,2.67 30.94,4.27 30.94,6.93 U$8.P$2 | v36.27,9.07 54.41,9.07 56.36,7.11 57.07,7.11 U$9.P$2
  Route15 0.203: v9.6,62.05 9.6,55.83 11.2,54.23 11.02,54.05 11.02,49.61 14.05,46.58 14.05,46.23 13.87,46.05 13.87,45.52 14.05,45.34 14.05,42.85 16.54,40.36 16.54,38.76 16.36,38.58 16.36,37.87 16.54,37.69 16.54,35.56 16.71,35.38 16.71,34.67 16.54,34.49 16.54,27.2 16.89,26.85 16.89,25.25 18.67,23.47 18.67,17.6 11.02,9.96 10.31,9.96 v9.6,10.67
  Bottom 0.203: v9.6,10.67 10.13,11.2 10.13,12.09 IC1.4 | v9.6,62.05 9.6,63.83 8.89,64.54 8,64.54 U$14.8 | v36.27,9.07 33.25,9.07 31.11,6.93 U$8.P$2
D5  (via drill 0.3)
  Top 0.203: 9.6,12.98 v9.6,13.51 | 9.6,12.98 4.98,8.36 3.91,8.36 2.67,7.11 U$3.P$1 | 9.6,12.98 11.2,12.98 16.54,7.64 16.54,6.58 17.42,5.69 25.96,5.69 27.2,6.93 28.45,6.93 U$8.P$1 | v73.79,65.61 74.68,65.61 78.77,61.52 78.77,33.96 59.03,14.22 59.03,8.18 58.32,7.47 58.32,6.4 57.61,5.69 55.83,5.69 54.59,6.93 U$9.P$1 | v32.18,9.96 35.74,9.96 36.27,10.49 53.87,10.49 v54.94,9.42
  Bottom 0.203: v9.6,13.51 9.6,12.27 IC1.5 | v73.79,65.61 63.48,75.92 47.3,75.92 46.76,75.39 36.8,75.39 36.09,76.1 8.71,76.1 5.51,72.9 5.51,72.19 6.04,71.65 6.76,71.65 7.29,72.19 7.29,72.72 8,73.43 10.49,73.43 11.02,72.9 11.02,72.19 9.42,70.59 9.42,65.96 8.89,65.43 8,65.43 U$14.9 | v32.18,9.96 29.34,7.11 28.63,7.11 U$8.P$1 | v54.94,9.42 54.94,7.47 54.59,7.11 U$9.P$1
D6  (via drill 0.3)
  Top 0.203: v6.93,11.2 4.62,13.51 v4.62,20.62 | v2.67,28.45 2.67,34.85 U$3.P$20 | v10.67,67.39 10.67,62.05 3.02,54.41 v3.02,45.52 | v12.98,29.34 12.98,29.69 13.69,30.4 23.65,30.4 28.09,34.85 28.45,34.85 U$8.P$20 28.63,35.03 28.63,41.78 29.34,42.49 29.69,42.49 30.23,41.96 30.23,41.6 29.87,41.25 29.87,37.69 30.58,36.98 31.65,36.98 32.36,37.69 32.36,38.58 37.69,43.92 v39.29,43.92 | v51.56,39.29 54.41,36.45 54.41,35.03 U$9.P$20
  Route15 0.203: v3.02,45.52 2.13,44.63 2.13,43.74 2.31,43.56 2.31,35.92 2.49,35.74 2.49,35.03 U$3.P$20 | v12.98,29.34 9.6,25.96 6.4,25.96 3.91,28.45 v2.67,28.45
  Bottom 0.203: v6.93,11.2 7.11,11.02 8.71,11.02 8.89,11.2 8.89,12.09 IC1.6 | v4.62,20.62 4.62,21.51 2.67,23.47 v2.67,28.45 | v10.67,67.39 10.67,68.99 U$14.13 | v51.56,39.29 50.14,37.87 50.14,37.69 49.43,36.98 45.87,36.98 44.98,37.87 44.98,38.76 39.83,43.92 v39.29,43.92
D7  (via drill 0.3)
  Top 0.203: v8.36,13.51 8.71,13.51 9.42,14.22 14.22,14.22 | 14.22,14.22 17.78,14.22 24.89,7.11 25.43,7.11 U$3.P$10 | v22.05,61.7 22.05,56.19 24.36,53.87 24.36,53.16 23.82,52.63 23.11,52.63 22.4,53.34 22.4,53.87 21.87,54.41 21.34,54.41 20.8,53.87 20.8,49.07 v20.98,48.9 | v19.2,46.76 19.2,41.25 16.54,38.58 16.54,34.31 11.91,29.69 11.91,28.98 14.05,26.85 v14.22,26.85 | 14.22,14.22 v14.22,25.07 | v48.54,9.78 36.09,9.78 v34.67,8.36 | v54.05,1.78 54.05,2.49 v54.59,3.02
  Bottom 0.203: v8.36,13.51 8.36,12.27 IC1.7 | v22.05,61.7 21.69,62.05 20.27,62.05 U$14.29 | v20.98,48.9 20.98,48.54 v19.2,46.76 | v14.22,25.07 v14.22,26.85 | v48.54,9.78 48.72,9.78 51.38,7.11 U$8.P$10 51.56,6.93 54.59,3.91 v54.59,3.02 | v34.67,8.36 33.25,8.36 32.36,7.47 32.36,6.4 31.65,5.69 26.85,5.69 25.6,6.93 U$3.P$10 | v54.05,1.78 54.94,0.89 76.1,0.89 78.23,3.02 78.23,4.98 77.52,5.69 77.52,6.93 U$9.P$10
D8  (via drill 0.3)
  Top 0.203: v32,28.09 30.76,29.34 30.76,32.89 30.05,33.6 29.69,33.6 28.45,32.36 v28.45,32.18
  Route15 0.203: v18.67,55.3 18.67,52.09 25.25,45.52 25.25,35.2 25.43,35.03 U$3.P$11 | v32,28.09 44.27,28.09 51.03,34.85 51.38,34.85 U$8.P$11
  Bottom 0.203: U$8.P$11 51.56,35.03 51.56,37.34 56.19,41.96 56.19,42.32 58.14,44.27 67.39,44.27 68.63,45.52 68.63,46.41 69.34,47.12 70.23,47.12 71.12,46.23 71.12,43.74 77.34,37.52 77.34,35.03 U$9.P$11 | v32,28.09 32.54,27.56 32.54,24.71 27.74,19.91 26.67,19.91 25.6,18.85 25.6,18.14 IC2.15 | v28.45,32.18 25.6,35.03 U$3.P$11 | v18.67,55.3 18.67,62.41 19.2,62.94 20.09,62.94 U$14.28
D9  (via drill 0.3)
  Top 0.203: U$9.P$8 72.19,6.93 65.96,0.71 52.09,0.71 46.41,6.4 46.41,6.93 U$8.P$8
  Route15 0.203: v23.11,61.7 23.11,61.34 25.78,58.67 25.78,38.94 25.6,38.76 25.6,36.8 26.85,35.56 26.85,29.69 25.6,28.45 25.6,13.51 20.8,8.71 20.8,8.36 20.45,8 20.45,7.11 U$3.P$8
  Bottom 0.203: 26.14,11.38 26.14,9.6 24.18,7.64 24.18,6.58 23.29,5.69 21.69,5.69 20.45,6.93 U$3.P$8 | 26.14,11.38 26.14,12.09 IC2.1 26.14,11.38 | v23.11,61.7 21.16,63.65 20.27,63.65 U$14.27 | 26.14,11.38 41.25,11.38 45.52,7.11 46.23,7.11 U$8.P$8
D10  (via drill 0.3)
  Top 0.203: v22.23,68.1 26.31,68.1 29.16,70.94 v69.34,70.94 | U$8.P$9 48.9,6.93 48.9,4.45 52.27,1.07 65.61,1.07 71.12,6.58 71.12,7.64 71.83,8.36 73.61,8.36 74.85,7.11 U$9.P$9
  Bottom 0.203: IC2.2 25.43,12.09 25.43,9.6 22.94,7.11 U$3.P$9 22.76,7.11 22.05,7.11 20.8,8.36 19.91,8.36 19.02,7.47 19.02,6.58 22.58,3.02 44.81,3.02 48.72,6.93 U$8.P$9 | v22.23,68.1 22.23,65.79 21.16,64.72 20.27,64.72 U$14.26 | v69.34,70.94 79.12,61.16 79.12,10.85 75.39,7.11 75.03,7.11 U$9.P$9
D11  (via drill 0.3)
  Route15 0.203: v27.91,40.18 27.91,38.58 27.2,37.87 27.2,34.31 29.16,32.36 29.16,26.67 v33.25,22.58
  Bottom 0.203: v27.91,40.18 27.91,41.07 29.34,42.49 29.52,42.49 32.36,45.34 32.36,46.23 43.2,57.07 43.2,66.32 44.09,67.21 44.09,68.99 R1.1 | v33.25,22.58 33.25,16 34.85,14.4 34.85,13.16 34.67,12.98 32.18,12.98 31.29,12.09 27.74,12.09 26.49,13.34 25.25,13.34 25.07,13.16 25.07,12.27 IC2.3
ESP_RESET
  Bottom 0.203: 65.96,9.96 65.96,6.58 66.14,6.4 66.14,1.42 65.96,1.25 55.47,1.25 50.14,6.58 50.14,7.64 49.43,8.36 48.36,8.36 44.63,12.09 42.14,12.09 SW4.2 | 65.96,9.96 64.54,11.38 X1.4 64.54,11.56 61.16,14.94 51.03,14.94 R8.1 | 65.96,9.96 68.99,9.96 70.41,11.38 X1.1
ESP_RX
  Bottom 0.203: D4.A 69.7,30.94 69.7,27.74 68.63,26.67 X1.15
ESP_TX
  Bottom 0.203: X1.16 70.59,26.49 70.59,13.51 71.48,12.62 71.48,8 71.12,7.64 71.12,6.22 67.92,3.02 J3.2
GND  (via drill 0.3)
  Bottom 0.203: 29,14.12 C4.2 29.16,14.22 32.72,14.22 33.07,14.58 v33.12,14.75 34,13.88 SW3.1 | 15,14.12 C5.1 15.11,14.05 19.91,14.05 20.98,12.98 20.98,12.27 v20.88,12.12 21.62,12.12 IC2.8 | v41.12,14.75 42,13.88 SW4.1 | v4,26.88 C1.2 | v9.62,29 9.62,27.88 U$17.6 | v4.12,32 C8.1 | v18,26.88 C2.2 | v23.62,29 23.62,27.88 U$21.6 | v38.12,18 C3.2 | v48.12,12 C11.1 | v38.38,23.62 37.25,23.62 U$20.6 | v30.12,32 C9.1 | v16.88,50 C7.1 | v48.12,27 R10.1 | v56.12,32 C10.1 | v52.38,50.38 52.38,49.25 U$13.6 | v58,50.12 C6.1 | v6.88,12.12 7.62,12.12 IC1.8 | v10.25,19.38 10.25,18.12 IC1.13 | v24.25,19.38 24.25,18.12 IC2.13 | v55.38,26.5 X1.9 | v14.75,70.75 14.75,69.12 U$14.18 | v38.12,77.5 38.12,76.38 U1.1 | v58.75,3 J3.6 | v47.5,75.25 47.5,74 C15.- | v58.5,75.25 58.5,74 C14.-
  pour Route2: 0,0 80,0 80,80 0,80
GPIO0  (via drill 0.3)
  Top 0.203: v37.34,14.94 42.14,19.74 v49.78,19.74
  Bottom 0.203: v37.34,14.94 34.67,12.27 34.14,12.27 SW3.2 | v49.78,19.74 51.03,20.98 R16.1 51.03,21.16 57.25,21.16 61.52,25.43 61.52,25.6 62.41,26.49 X1.12
LATCH  (via drill 0.3)
  Top 0.203: 12.8,26.14 12.8,25.78 11.73,24.71 11.73,18.14 v10.31,16.71 | 12.8,26.14 v12.8,26.49 | 12.8,26.14 18.14,26.14 18.67,26.67 v26.85,26.67 27.38,26.14 36.09,26.14 | 50.67,28.27 50.49,28.27 48.36,26.14 36.09,26.14 | v49.25,48.01 49.25,47.12 50.14,46.23 50.14,32 50.67,31.47 50.67,28.27 | 50.67,28.27 v50.85,28.27 51.03,28.09 v57.07,28.09 | 36.09,26.14 v36.09,26.49
  Bottom 0.203: 36.09,26.31 29.87,20.09 29.87,15.29 29.69,15.11 24.89,15.11 23.65,16.36 23.65,17.96 IC2.12 | 36.09,26.31 36.63,26.85 37.16,26.85 U$20.11 | v12.8,26.49 12.8,27.74 U$17.11 | v10.31,16.71 10.13,16.71 9.78,17.07 9.78,17.96 IC1.12 | v26.85,26.67 26.85,27.74 U$21.11 | v50.85,28.27 50.85,27.03 R10.2 | v49.25,48.01 49.25,49.07 U$13.11 | v57.07,28.09 58.5,26.67 X1.10 | v36.09,26.49 36.09,26.31
MOSI  (via drill 0.3)
  Top 0.203: v52.09,12.8 v31.11,12.8
  Bottom 0.203: v31.11,12.8 28.8,12.8 27.91,13.69 23.65,13.69 17.78,19.56 11.56,19.56 11.02,19.02 11.02,18.14 IC1.14 | v52.09,12.8 57.25,12.8 58.5,11.56 X1.7
N$1  (via drill 0.3)
  Top 0.203: U$4.A 33.6,68.1 34.85,68.1 36.09,69.34 40.18,69.34 41.43,68.1 U$10.A | v11.02,20.98 11.02,22.23 11.38,22.58 11.38,31.83 14.05,34.49 14.05,44.63 15.11,45.7 U$1.P$12
  Bottom 0.203: v11.02,20.98 11.56,20.98 12.27,21.69 12.27,22.05 U$17.15 | U$4.A 33.43,68.1 32.36,68.1 30.76,69.7 27.91,69.7 24.71,66.5 24.71,55.83 22.4,53.52 22.4,52.98 15.29,45.87 U$1.P$12
N$2  (via drill 0.3)
  Top 0.203: v12.45,23.47 12.45,17.96 10.49,16 10.13,16 0.89,25.25 0.89,41.6 4.98,45.7 U$1.P$16 5.16,45.87 9.07,49.78 9.07,57.25 16.18,64.36 17.42,64.36 18.49,65.43 28.45,65.43 U$4.F
  Bottom 0.203: U$4.F 28.45,65.61 28.45,66.32 27.2,67.56 27.2,68.45 28.09,69.34 30.58,69.34 33.07,66.85 35.2,66.85 36.45,65.61 U$10.F | v12.45,23.47 12.27,23.47 11.73,22.94 11.73,22.23 U$17.16
N$3
  Top 0.203: U$10.B 41.43,65.61 40.18,66.85 36.09,66.85 34.85,65.61 33.6,65.61 U$4.B 33.43,65.43 30.05,65.43 28.8,64.19 17.78,64.19 12.8,59.21 12.62,59.21 11.02,57.61 11.02,49.07 7.82,45.87 U$1.P$15
  Bottom 0.203: U$17.17 11.02,22.23 11.02,23.65 8.71,25.96 6.93,25.96 1.25,31.65 1.25,39.29 7.64,45.7 U$1.P$15
N$4  (via drill 0.3)
  Top 0.203: U$10.G 36.45,62.94 35.2,61.7 33.07,61.7 31.83,62.94 28.63,62.94 U$4.G 28.45,62.94 28.45,62.23 25.07,58.85 v25.07,51.38 | v10.31,23.47 10.31,33.07 8.89,34.49 8.89,40.18 14.05,45.34 14.05,46.23 15.29,47.47 21.16,47.47 22.76,45.87 U$1.P$9
  Bottom 0.203: v10.31,23.47 10.31,22.23 U$17.18 | v25.07,51.38 25.07,48.01 22.94,45.87 U$1.P$9
N$5  (via drill 0.3)
  Top 0.203: U$4.C 33.6,63.12 34.85,63.12 35.92,64.19 40.36,64.19 41.43,63.12 U$10.C | v5.87,23.29 5.87,24 1.25,28.63 1.25,35.38 3.91,38.05 4.98,38.05 U$1.P$1 5.16,38.23 8.89,41.96 8.89,46.23 11.56,48.9 v20.09,48.9
  Bottom 0.203: v5.87,23.29 8.53,23.29 8.89,22.94 8.89,22.23 U$17.20 | v20.09,48.9 23.29,52.09 32.36,52.09 37.69,57.43 37.69,58.32 41.43,62.05 41.43,62.94 U$10.C
N$6  (via drill 0.3)
  Top 0.203: v8.36,20.98 8.36,32.54 6.4,34.49 6.4,38.94 11.56,44.09 11.56,46.41 12.98,47.83 22.58,47.83 22.76,47.65 | 22.76,47.65 24.18,46.23 24.18,41.96 20.45,38.23 U$1.P$7 | 22.76,47.65 29.69,54.59 29.69,58.32 28.63,59.38 28.63,60.45 U$4.E
  Bottom 0.203: U$4.E 28.63,60.45 29.34,60.45 33.07,56.72 33.96,56.72 35.2,57.96 35.2,59.21 36.45,60.45 U$10.E | v8.36,20.98 8.36,22.05 U$17.21
N$7
  Top 0.203: U$10.DP 41.43,60.63 40.36,61.7 35.92,61.7 34.85,60.63 33.6,60.63 U$4.DP 33.43,60.45 33.43,59.56 30.05,56.19 30.05,46.94 22.94,39.83 22.94,38.23 U$1.P$8
  Bottom 0.203: U$17.22 7.64,22.05 7.64,20.8 6.76,19.91 4.45,19.91 0.89,23.47 0.89,39.83 6.4,45.34 6.4,46.23 7.82,47.65 12.62,47.65 14.05,46.23 14.05,45.34 19.91,39.47 21.51,39.47 22.76,38.23 U$1.P$8
N$8  (via drill 0.3)
  Top 0.203: v6.93,20.98 7.47,20.98 8.18,20.27 8.53,20.27 11.02,22.76 11.02,33.6 v11.38,33.96 | v11.2,46.94 12.45,48.18 22.76,48.18 28.45,53.87 28.45,57.78 U$4.D
  Route15 0.203: v11.38,33.96 11.38,36.45 12.27,37.34 12.27,37.52 12.8,38.05 U$1.P$4
  Bottom 0.203: U$4.D 28.63,57.78 31.47,57.78 32.89,56.36 35.03,56.36 36.45,57.78 U$10.D | v6.93,20.98 6.93,22.05 U$17.23 | v11.2,46.94 11.2,46.58 11.56,46.23 11.56,39.29 12.62,38.23 U$1.P$4
N$9
  Bottom 0.203: U$17.2 6.93,27.91 6.93,29.33 6.22,30.04 6.22,34.31 6.4,34.49 6.4,41.96 10.13,45.7 U$1.P$14
N$10
  Bottom 0.203: U$17.3 7.82,27.91 7.82,33.43 8.89,34.49 8.89,36.8 10.13,38.05 U$1.P$3
N$11  (via drill 0.3)
  Top 0.203: v13.34,25.43 13.69,25.43 14.05,25.78 v19.2,25.78
  Bottom 0.203: v13.34,25.43 10.13,25.43 8.53,27.03 8.53,27.74 U$17.4 | v19.2,25.78 19.2,34.31 19.02,34.49 19.02,39.47 12.8,45.7 U$1.P$13
N$12  (via drill 0.3)
  Route15 0.203: v12.09,33.43 13.34,33.43 14.05,34.14 14.05,34.49 13.87,34.67 13.87,35.2 14.05,35.38 14.05,35.74 15.47,37.16 15.47,37.34 15.29,37.52 15.29,38.05 U$1.P$5
  Bottom 0.203: v12.09,33.43 8.89,30.23 8.89,27.91 U$17.5
N$13  (via drill 0.3)
  Top 0.203: v15.29,40.72 15.29,43.2 17.78,45.7 U$1.P$11
  Bottom 0.203: v15.29,40.72 14.05,39.47 14.05,34.49 10.49,30.94 10.49,27.91 U$17.7
N$14
  Bottom 0.203: U$17.8 11.02,27.91 11.02,29.34 15.29,33.6 15.65,33.6 16.54,34.49 16.54,36.8 17.78,38.05 U$1.P$6
N$15  (via drill 0.3)
  Top 0.203: U$12.A 61.52,68.1 60.27,69.34 56.01,69.34 54.76,68.1 53.7,68.1 U$11.A 53.52,67.92 49.96,67.92 48.9,66.85 48.01,66.85 47.3,66.14 47.3,65.08 48.18,64.19 48.9,64.19 50.32,62.76 50.32,55.3 v48.36,53.34 | v31.65,29.34 31.65,32.36 31.29,32.72 31.29,33.43 32.36,34.49 32.36,35.56 33.78,36.98 34.14,36.98 35.03,37.87 35.03,38.76 41.25,44.98 41.25,45.7 U$6.P$12 41.43,45.87 42.67,47.12 43.92,47.12 v46.94,50.14
  Bottom 0.203: v31.65,29.34 31.47,29.34 26.31,24.18 26.31,22.23 U$21.15 | v48.36,53.34 46.94,51.92 v46.94,50.14
N$16  (via drill 0.3)
  Top 0.203: U$11.F 48.54,65.61 51.92,65.61 53.16,66.85 55.12,66.85 56.36,65.61 U$12.F | v21.16,32.36 22.05,32.36 24.18,34.49 24.18,37.16 25.6,38.58 25.6,40.36 30.94,45.7 U$6.P$16 31.11,45.87 37.16,51.92 40.01,51.92 46.23,58.14 46.23,67.56 48.01,69.34 48.9,69.34 49.61,68.63 v49.96,68.63
  Bottom 0.203: v21.16,32.36 19.56,30.76 19.56,27.38 21.69,25.25 24,25.25 25.6,23.65 25.6,22.23 U$21.16 | v49.96,68.63 49.96,67.92 48.54,66.5 48.54,65.61 U$11.F
N$17  (via drill 0.3)
  Top 0.203: v24.89,23.47 27.91,23.47 30.23,25.78 55.65,25.78 57.78,27.91 57.78,29.34 52.81,34.31 52.81,37.16 50.85,39.12 50.85,51.21 | 50.85,51.21 50.85,62.76 53.52,65.43 U$11.B 53.7,65.43 54.76,64.36 57.07,64.36 58.14,65.43 61.52,65.43 U$12.B | 50.85,51.21 39.83,51.21 34.49,45.87 33.78,45.87 U$6.P$15
  Bottom 0.203: v24.89,23.47 24.89,22.23 U$21.17
N$18  (via drill 0.3)
  Top 0.203: v24.89,20.98 25.96,20.98 30.4,25.43 55.83,25.43 58.14,27.74 58.14,32.18 55.83,34.49 55.83,41.78 55.47,42.14 55.47,45.87 | 55.47,45.87 55.47,54.94 57.61,57.07 57.61,61.87 56.54,62.94 U$12.G | 55.47,45.87 v51.56,45.87
  Bottom 0.203: v24.89,20.98 24.36,21.51 24.36,22.05 U$21.18 | v51.56,45.87 48.9,45.87 U$6.P$9 | U$11.G 48.54,63.12 49.43,63.12 53.16,66.85 56.9,66.85 58.5,65.25 58.5,64.01 57.61,63.12 56.54,63.12 U$12.G
N$19  (via drill 0.3)
  Top 0.203: v57.78,64.19 60.45,64.19 61.52,63.12 U$12.C | v31.83,27.2 32,27.2 32.72,27.91 32.72,32.18 v32,32.89 | v49.61,62.05 49.25,62.05 48.9,61.7 48.01,61.7 46.58,60.27 46.58,57.96 40.18,51.56 37.69,51.56 32.36,46.23 32.36,39.47 31.11,38.23 U$6.P$1
  Bottom 0.203: v57.78,64.19 56.01,64.19 54.94,63.12 53.7,63.12 U$11.C 53.52,62.94 50.49,62.94 v49.61,62.05 | v31.83,27.2 31.83,24.54 27.56,20.27 24.36,20.27 23.11,21.51 23.11,22.05 U$21.20 | v32,32.89 32,31.47 31.65,31.11 30.05,31.11 29.16,32 29.16,33.78 29.87,34.49 29.87,36.98 30.94,38.05 U$6.P$1
N$20  (via drill 0.3)
  Top 0.203: v22.4,20.27 21.69,19.56 21.69,19.02 22.05,18.67 27.38,18.67 v29.69,20.98 | v36.09,27.38 36.45,27.38 42.49,33.43 42.49,35.38 44.09,36.98 45.16,36.98 46.23,38.05 U$6.P$7 | v47.83,51.92 47.65,52.09 47.65,53.52 49.61,55.47 49.61,58.5 48.54,59.56 48.54,60.45 U$11.E
  Bottom 0.203: U$11.E 48.36,60.63 46.94,62.05 46.94,68.28 48.01,69.34 65.79,69.34 68.1,67.03 68.1,66.5 63.3,61.7 59.03,61.7 57.96,60.63 56.54,60.63 U$12.E | v22.4,20.27 22.4,22.05 U$21.21 | v36.09,27.38 v29.69,20.98 | v47.83,51.92 47.83,46.41 47.65,46.23 47.65,39.47 46.41,38.23 U$6.P$7
N$21  (via drill 0.3)
  Top 0.203: v20.62,18.67 20.98,18.67 21.69,17.96 37.16,17.96 41.78,22.58 54.41,22.58 59.74,27.91 59.74,33.07 58.32,34.49 58.32,39.83 55.83,42.32 55.83,47.3 | 55.83,47.3 55.83,54.76 61.52,60.45 U$12.DP | 55.83,47.3 v61.52,47.3 | v55.65,59.21 54.41,60.45 53.7,60.45 U$11.DP
  Bottom 0.203: v20.62,18.67 21.69,19.74 21.69,22.05 U$21.22 | v61.52,47.3 61.34,47.47 56.54,47.47 48.9,39.83 48.9,38.23 U$6.P$8 | v55.65,59.21 60.27,59.21 61.52,60.45 U$12.DP
N$22  (via drill 0.3)
  Top 0.203: v19.91,23.29 23.82,23.29 25.25,24.71 v28.27,24.71 | v30.94,26.85 31.29,26.85 31.65,26.49 32,26.49 37.52,32 37.52,36.98 38.58,38.05 U$6.P$4 38.76,38.23 v44.45,43.92 | v44.98,52.09 48.36,55.47 48.36,57.78 U$11.D
  Route15 0.203: U$11.D 48.54,57.78 48.9,57.78 50.32,56.36 54.05,56.36 55.47,57.78 56.36,57.78 U$12.D
  Bottom 0.203: v19.91,23.29 20.62,23.29 20.98,22.94 20.98,22.23 U$21.23 | v28.27,24.71 29.16,24.71 29.52,25.07 30.58,25.07 30.94,25.43 v30.94,26.85 | v44.98,52.09 44.98,44.45 v44.45,43.92
N$23
  Bottom 0.203: U$21.2 21.16,27.91 21.16,31.47 24.18,34.49 24.18,35.56 32.89,44.27 34.67,44.27 36.09,45.7 U$6.P$14
N$24  (via drill 0.3)
  Top 0.203: v27.74,31.47 28.63,31.47 29.87,32.72 v29.87,32.89
  Bottom 0.203: v27.74,31.47 24,31.47 21.87,29.34 21.87,27.91 U$21.3 | v29.87,32.89 30.76,32.89 32.36,34.49 32.36,35.56 33.78,36.98 35.03,36.98 36.09,38.05 U$6.P$3
N$25
  Bottom 0.203: U$21.4 22.4,27.74 22.4,27.2 24,25.6 27.2,25.6 30.94,29.34 30.94,29.52 31.47,30.05 37.16,30.05 40.72,33.6 41.78,33.6 42.49,34.31 42.49,39.83 38.58,43.74 38.58,45.7 U$6.P$13
N$26  (via drill 0.3)
  Top 0.203: v22.94,29.52 23.11,29.52 23.29,29.69 25.43,29.69 25.78,29.34 v27.38,29.34
  Bottom 0.203: v22.94,29.52 22.94,27.91 U$21.5 | v27.38,29.34 29.16,29.34 30.23,30.4 35.92,30.4 40.01,34.49 40.01,36.8 41.25,38.05 U$6.P$5
N$27
  Bottom 0.203: U$21.7 24.36,27.91 24.36,29.34 25.78,30.76 33.78,30.76 37.52,34.49 37.52,46.23 38.41,47.12 42.49,47.12 43.74,45.87 U$6.P$11
N$28  (via drill 0.3)
  Top 0.203: v25.07,28.98 26.85,28.98 27.2,28.63 29.34,28.63 v30.05,29.34
  Route15 0.203: v30.05,29.34 30.76,29.34 34.85,33.43 36.63,33.43 37.34,34.14 37.34,35.56 38.41,36.63 41.96,36.63 43.38,38.05 43.74,38.05 U$6.P$6
  Bottom 0.203: v25.07,28.98 25.07,27.91 U$21.8
N$29  (via drill 0.3)
  Route15 0.203: v49.61,31.65 50.67,31.65 53.52,34.49 53.52,36.09 61.34,43.92 65.08,43.92 66.85,45.7 67.21,45.7 U$7.P$12
  Bottom 0.203: v49.61,31.65 44.27,26.31 42.85,26.31 U$20.15
N$30
  Bottom 0.203: U$20.16 42.85,25.78 44.63,25.78 50.32,31.47 50.32,34.31 50.14,34.49 50.14,36.45 54.05,40.36 54.05,42.67 57.07,45.7 U$7.P$16
N$31  (via drill 0.3)
  Top 0.203: v56.9,42.14 56.9,43.03 59.56,45.7 U$7.P$15
  Bottom 0.203: v56.9,42.14 52.98,38.23 52.98,33.6 44.45,25.07 42.85,25.07 U$20.17
N$32  (via drill 0.3)
  Top 0.203: v50.67,19.74 52.63,19.74 65.96,33.07 65.96,35.38 67.56,36.98 67.74,36.98 68.63,37.87 68.63,39.47 74.85,45.7 U$7.P$9
  Route15 0.203: v50.67,19.74 v46.05,24.36
  Bottom 0.203: v46.05,24.36 42.85,24.36 U$20.18
N$33
  Bottom 0.203: U$20.20 42.85,23.11 45.7,23.11 48.72,26.14 49.61,26.14 49.78,26.31 49.78,27.91 49.25,28.45 49.25,28.8 54.05,33.6 54.94,33.6 55.83,34.49 55.83,36.8 57.07,38.05 U$7.P$1
N$34  (via drill 0.3)
  Top 0.203: v42.85,18.31 57.43,18.31 v71.12,32
  Bottom 0.203: v42.85,18.31 41.43,19.74 41.43,21.69 41.96,22.23 42.67,22.23 U$20.21 | v71.12,32 73.61,34.49 73.61,36.8 72.36,38.05 U$7.P$7
N$35  (via drill 0.3)
  Top 0.203: v43.38,19.02 55.65,19.02 71.12,34.49 71.12,35.56 72.54,36.98 73.79,36.98 74.85,38.05 U$7.P$8
  Bottom 0.203: v43.38,19.02 42.85,19.02 41.78,20.09 41.78,21.34 42.14,21.69 42.67,21.69 U$20.22
N$36
  Bottom 0.203: U$20.23 42.85,21.16 44.27,21.16 48.9,25.78 51.92,25.78 57.25,31.11 60.1,31.11 63.48,34.49 63.48,36.8 64.72,38.05 U$7.P$4
N$37  (via drill 0.3)
  Top 0.203: v38.41,21.16 38.41,22.76 v39.29,23.65
  Bottom 0.203: v38.41,21.16 37.34,21.16 U$20.2 | v39.29,23.65 39.29,26.31 40.18,27.2 40.18,30.76 43.03,33.6 46.76,33.6 47.65,34.49 47.65,35.56 48.72,36.63 49.78,36.63 53.7,40.54 53.7,44.09 56.72,47.12 60.81,47.12 62.05,45.87 U$7.P$14
N$38  (via drill 0.3)
  Route15 0.203: v39.83,21.87 41.25,21.87 48.01,28.63 v49.96,28.63
  Bottom 0.203: v39.83,21.87 37.34,21.87 U$20.3 | v49.96,28.63 50.32,28.63 54.94,33.25 57.25,33.25 58.32,34.31 58.32,35.38 59.92,36.98 60.98,36.98 62.05,38.05 U$7.P$3
N$39  (via drill 0.3)
  Route15 0.203: v41.6,24.54 50.49,33.43 51.92,33.43 53.16,34.67 53.16,36.27 61.16,44.27 62.94,44.27 64.36,45.7 64.72,45.7 U$7.P$13
  Bottom 0.203: v41.6,24.54 40.54,23.47 40.54,21.69 38.41,19.56 35.92,19.56 35.38,20.09 35.38,21.16 36.45,22.23 37.16,22.23 U$20.4
N$40  (via drill 0.3)
  Top 0.203: v39.83,22.94 52.27,22.94 v52.81,23.47
  Bottom 0.203: v39.83,22.94 37.34,22.94 U$20.5 | v52.81,23.47 52.81,24.89 56.9,28.98 65.61,28.98 67.03,30.4 67.03,33.43 65.96,34.49 65.96,36.8 67.21,38.05 U$7.P$5
N$41  (via drill 0.3)
  Top 0.203: v47.12,26.85 v38.94,26.85
  Bottom 0.203: v38.94,26.85 38.94,25.43 37.87,24.36 37.34,24.36 U$20.7 | v47.12,26.85 47.12,27.2 53.34,33.43 53.34,36.09 61.16,43.92 67.92,43.92 69.7,45.7 U$7.P$11
N$42  (via drill 0.3)
  Top 0.203: v36.09,24 37.87,24 38.23,24.36 39.47,24.36 40.18,23.65 52.09,23.65 53.52,25.07 56.01,25.07 v59.03,28.09
  Bottom 0.203: v36.09,24 36.09,24.54 36.45,24.89 37.16,24.89 U$20.8 | v59.03,28.09 65.25,28.09 71.12,33.96 71.12,36.8 69.88,38.05 U$7.P$6
N$43
  Bottom 0.203: U$2.G1 4.62,53.52 5.16,53.52 7.11,55.47 11.02,55.47 11.56,56.01 11.56,56.9 U$14.42
N$44
  Bottom 0.203: R2.2 46.05,52.98 46.58,52.98 48.36,54.76 U$13.13
N$45
  Bottom 0.203: R3.2 41.07,29.87 41.07,29.34 42.67,27.74 U$20.13
N$46
  Bottom 0.203: U$21.13 27.74,22.23 28.09,22.23 29.87,24 R4.2
N$47
  Bottom 0.203: U$17.13 13.69,22.23 14.05,22.23 15.82,24 R5.2
N$48  (via drill 0.3)
  Top 0.203: v17.07,15.11 22.94,15.11 v24.36,16.54
  Bottom 0.203: v17.07,15.11 9.78,15.11 7.82,17.07 7.82,17.96 IC1.9 | v24.36,16.54 24.89,17.07 24.89,17.96 IC2.14
N$49  (via drill 0.3)
  Top 0.203: v18.49,66.32 17.42,66.32 16.54,67.21 16.54,67.56 16.71,67.74 16.71,72.9 16.18,73.43 15.65,73.43 15.11,72.9 15.11,72.36 14.05,71.3 14.05,63.65 8.36,57.96 8.36,53.52 U$2.CAT1
  Bottom 0.203: v18.49,66.32 20.09,66.32 U$14.24
N$51  (via drill 0.3)
  Top 0.203: v43.92,20.45 52.81,20.45 63.48,31.11 63.48,46.23 v60.98,48.72
  Bottom 0.203: v43.92,20.45 42.85,20.45 U$20.24 | v60.98,48.72 56.01,48.72 55.65,49.07 U$13.1
N$52
  Top 0.203: D1.K 44.98,61.34 44.98,63.65 D2.A
N$53
  Bottom 0.203: R1.2 45.87,68.99 45.87,67.03 45.16,66.32 D2.K
N$54
  Bottom 0.203: U$2.A1 10.13,72.36 10.13,71.83 4.62,66.32 4.62,60.45 5.16,59.92 7.82,59.92 U$14.2
N$55  (via drill 0.3)
  Top 0.203: v53.16,45.16 53.16,44.09 v54.76,42.49
  Bottom 0.203: v53.16,45.16 51.74,46.58 51.74,49.07 U$13.7 | v54.76,42.49 55.83,42.49 57.96,44.63 65.25,44.63 65.96,45.34 65.96,46.58 75.74,56.36 75.74,62.05 74.85,62.94 73.61,62.94 67.21,69.34 U$5.C1
N$56  (via drill 0.3)
  Route15 0.203: v54.05,51.21 56.01,51.21 57.96,53.16 58.85,53.16 65.96,60.27 65.96,63.12 66.85,64.01 66.85,64.19 67.03,64.36 U$5.C2
  Bottom 0.203: v54.05,51.21 54.05,51.03 52.98,49.96 52.98,49.25 U$13.5
N$57  (via drill 0.3)
  Top 0.203: v56.54,50.85 62.59,50.85 74.68,62.94 74.68,64.19 U$5.C3
  Bottom 0.203: v56.54,50.85 54.59,50.85 53.7,49.96 53.7,49.25 U$13.4
N$58
  Bottom 0.203: U$13.3 54.41,49.07 54.41,48.54 54.94,48.01 66.14,48.01 74.68,56.54 U$5.C4
N$59
  Bottom 0.203: U$13.2 54.94,49.25 54.94,49.78 55.3,50.14 57.07,50.14 57.78,49.43 65.08,49.43 74.68,59.03 U$5.C5
N$60  (via drill 0.3)
  Top 0.203: v47.65,56.01 47.65,56.72 v46.94,57.43 | v46.23,71.65 72.54,71.65 74.68,69.52 U$5.R1
  Bottom 0.203: v47.65,56.01 49.07,56.01 49.61,55.47 49.61,54.94 U$13.15 | v46.94,57.43 46.94,61.52 46.58,61.87 46.58,71.3 v46.23,71.65
N$61  (via drill 0.3)
  Top 0.203: v56.54,53.7 56.9,53.7 59.92,56.72 63.48,56.72 73.43,66.67 74.68,66.67 U$5.R2
  Route15 0.203: v54.76,52.27 55.12,52.27 v56.54,53.7
  Bottom 0.203: v54.76,52.27 52.98,52.27 51.03,54.23 51.03,54.76 U$13.17
N$62
  Bottom 0.203: U$13.20 52.98,54.94 52.98,55.65 54.94,57.61 54.94,60.63 56.01,61.7 58.5,61.7 61.16,64.36 64.72,64.36 67.03,66.67 U$5.R3
N$63
  Bottom 0.203: U$13.23 54.94,54.94 54.94,55.47 55.12,55.65 59.56,55.65 59.92,55.3 60.63,55.3 66.32,60.98 66.32,62.05 66.85,62.59 73.97,62.59 74.68,61.87 U$5.R4
N$64
  Bottom 0.203: U$13.21 53.7,54.76 53.7,54.05 53.87,53.87 55.83,53.87 56.9,54.94 60.81,54.94 67.03,61.16 67.03,61.7 U$5.A5
N$65
  Bottom 0.203: U$13.16 50.49,54.76 50.49,54.05 52.63,51.92 54.23,51.92 54.59,51.56 57.07,51.56 57.61,52.09 60.1,52.09 67.03,59.03 U$5.A6
N$66  (via drill 0.3)
  Top 0.203: v52.27,57.07 52.63,57.07 53.34,56.36 v56.01,56.36 | v60.1,56.01 66.5,56.01 67.03,56.54 U$5.A7
  Bottom 0.203: v52.27,57.07 51.74,56.54 51.74,54.94 U$13.18 | v56.01,56.36 59.74,56.36 v60.1,56.01
N$67  (via drill 0.3)
  Route15 0.203: v16,60.63 17.07,61.7 17.07,63.83 13.69,67.21 13.69,71.12 12.45,72.36 12.27,72.36 U$2.B
  Bottom 0.203: v16,60.63 16,58.14 16.36,57.78 16.36,57.07 U$14.36
N$68
  Bottom 0.203: U$2.C 8.18,72.36 8.18,70.41 4.27,66.5 4.27,60.27 7.47,57.07 9.96,57.07 U$14.44
N$69  (via drill 0.3)
  Top 0.203: v36.09,20.27 29.52,20.27 27.56,18.31 21.87,18.31 v20.62,19.56
  Bottom 0.203: v36.09,20.27 37.16,20.27 U$20.1 | v20.62,19.56 20.62,21.34 20.45,21.51 20.45,22.05 U$21.24
N$70
  Bottom 0.203: U$2.CAT2 14.05,72.36 14.94,72.36 17.07,70.23 17.07,69.16 U$14.21
N$71  (via drill 0.3)
  Route15 0.203: v11.2,61.7 11.2,59.21 12.62,57.78 12.62,54.94 13.51,54.05 13.51,53.87 13.87,53.52 U$2.CAT3
  Bottom 0.203: v11.2,61.7 11.2,62.94 16.36,68.1 16.36,68.99 U$14.20
N$72  (via drill 0.3)
  Top 0.203: v22.94,62.76 24.71,60.98 24.71,52.98 24,52.27 22.76,52.27 21.69,53.34 U$2.CAT4
  Bottom 0.203: v22.94,62.76 22.94,70.05 20.62,72.36 20.62,72.72 19.91,73.43 13.69,73.43 13.16,72.9 13.16,72.19 13.87,71.48 14.94,71.48 15.47,70.94 15.47,69.16 U$14.19
N$73  (via drill 0.3)
  Top 0.203: v14.4,28.27 19.56,28.27 v20.27,28.98
  Route15 0.203: v5.69,22.23 7.64,22.23 13.69,28.27 v14.4,28.27
  Bottom 0.203: v5.69,22.23 6.4,22.23 U$17.24 | v20.27,28.98 20.27,27.91 U$21.1
N$77
  Bottom 0.203: U$2.A2 17.96,72.36 17.96,70.94 18.49,70.41 18.49,67.74 13.87,63.12 13.87,62.94 11.56,60.63 8,60.63 U$14.3
N$78
  Bottom 0.203: U$2.D2 10.31,53.34 10.31,51.38 12.98,48.72 17.07,48.72 18.85,50.49 18.85,54.59 20.09,55.83 20.09,58.85 U$14.33
N$79  (via drill 0.3)
  Top 0.203: v13.34,55.12 13.51,55.12 15.11,53.52 15.82,53.52 U$2.E
  Bottom 0.203: v13.34,55.12 12.45,56.01 12.45,56.9 U$14.41
N$80  (via drill 0.3)
  Route15 0.203: v16.36,63.65 16.36,63.83 13.34,66.85 13.34,67.21 12.98,67.56 11.56,67.56 7.47,71.65 7.11,71.3 5.87,71.3 4.8,72.36 4.62,72.36 U$2.F
  Bottom 0.203: v16.36,63.65 16.36,61.7 17.96,60.1 17.96,57.07 U$14.34
N$81
  Bottom 0.203: U$2.H 6.4,72.54 7.64,73.79 23.47,73.79 24.36,72.9 24.36,61.52 23.47,60.63 20.27,60.63 U$14.31
N$82  (via drill 0.3)
  Top 0.203: v17.25,65.08 16,66.32 16,72.36 U$2.I
  Bottom 0.203: v17.25,65.08 16.89,65.08 15.65,63.83 15.65,61.87 17.07,60.45 17.07,57.07 U$14.35
N$83
  Bottom 0.203: U$2.J 23.65,72.36 23.65,62.05 23.82,61.87 23.82,61.52 23.29,60.98 21.51,60.98 21.16,61.34 20.27,61.34 U$14.30
N$84  (via drill 0.3)
  Top 0.203: v14.4,58.67 19.56,53.52 U$2.K
  Bottom 0.203: v14.4,58.67 13.51,58.67 12.98,59.21 12.27,59.21 10.85,57.78 10.85,57.07 U$14.43
N$85
  Bottom 0.203: U$2.L 12.27,53.34 12.27,49.96 13.16,49.07 16.89,49.07 17.6,49.78 17.6,52.45 16.71,53.34 16.71,54.05 14.94,55.83 14.94,56.9 U$14.38
N$86  (via drill 0.3)
  Top 0.203: v12.8,58.5 17.78,53.52 U$2.M
  Bottom 0.203: v12.8,58.5 12.8,58.14 13.16,57.78 13.16,57.07 U$14.40
N$87  (via drill 0.3)
  Top 0.203: v13.87,59.38 17.6,59.38 23.47,53.52 U$2.D1
  Bottom 0.203: v13.87,59.38 13.34,59.38 13.16,59.56 9.42,59.56 8.89,59.03 8,59.03 U$14.1
N$88
  Bottom 0.203: U$2.DP 6.4,53.34 7.29,53.34 12.27,48.36 17.25,48.36 20.8,51.92 20.8,57.96 21.51,58.67 21.51,59.38 21.16,59.74 20.27,59.74 U$14.32
N$89
  Bottom 0.203: U$2.G2 19.56,72.36 19.56,68.28 15.29,64.01 15.29,57.25 15.47,57.07 U$14.37
N$90  (via drill 0.3)
  Top 0.203: v15.65,32 20.62,32 20.98,31.65 23.82,31.65 26.67,34.49 26.67,38.23 v26.31,38.58
  Bottom 0.203: v15.65,32 14.22,32 11.73,29.52 11.73,27.91 U$17.9 | v26.31,38.58 24.18,38.58 18.14,44.63 17.25,44.63 16.54,45.34 16.54,46.23 22.94,52.63 23.82,52.63 27.2,56.01 27.2,60.98 27.91,61.7 29.69,61.7 | 29.69,61.7 33.43,57.96 U$4.A2 | 29.69,61.7 29.69,65.96 28.63,67.03 28.63,67.92 U$4.A1
N$91  (via drill 0.3)
  Top 0.203: v15.11,31.29 24,31.29 27.2,34.49 v27.2,39.65
  Bottom 0.203: v15.11,31.29 14.05,31.29 12.27,29.52 12.27,27.91 U$17.10 | v27.2,39.65 27.2,43.56 41.43,57.78 U$10.A2 41.6,57.96 42.85,59.21 42.85,63.48 42.14,64.19 41.25,64.19 37.52,67.92 36.63,67.92 U$10.A1
N$92  (via drill 0.3)
  Top 0.203: v25.96,30.05 25.96,30.58 29.87,34.49 29.87,37.16 29.52,37.52 v29.52,41.78
  Bottom 0.203: v25.96,30.05 25.78,29.87 25.78,27.91 U$21.9 | v29.52,41.78 29.87,41.78 32.72,44.63 34.14,44.63 35.03,45.52 35.03,46.41 45.34,56.72 49.61,56.72 | 49.61,56.72 51.03,56.72 52.09,57.78 53.52,57.78 U$11.A2 | 49.61,56.72 49.61,60.98 48.9,61.7 48.01,61.7 47.3,62.41 47.3,66.14 48.36,67.21 48.36,67.92 U$11.A1
N$93  (via drill 0.3)
  Top 0.203: v28.45,27.74 14.76,27.74 14.58,27.56 13.87,27.56 12.27,29.16 12.27,29.52 16.36,33.6 18.31,33.6 19.02,34.31 19.02,35.38 20.62,36.98 23.47,36.98 25.25,38.76 25.25,41.6 40.36,56.72 40.36,58.5 41.07,59.21 41.96,59.21 43.74,60.98 43.74,66.85 46.58,69.7 61.7,69.7 62.76,68.63 62.76,67.56 62.05,66.85 | 62.05,66.85 57.61,66.85 56.54,67.92 U$12.A1 | 62.05,66.85 62.76,66.14 62.76,59.92 61.7,58.85 61.7,57.96 U$12.A2
  Bottom 0.203: v28.45,27.74 28.45,27.38 27.03,25.96 26.67,25.96 26.14,26.49 26.14,27.74 U$21.10
N$94
  Bottom 0.203: R9.1 51.03,17.96 60.1,17.96 66.5,11.56 X1.3
N$98
  Bottom 0.203: D4.C 66.14,30.94 60.45,30.94 58.85,29.34 56.01,29.34 51.56,24.89 48.54,24.89 47.47,23.82 47.47,11.73 49.07,10.13 57.25,10.13 58.32,9.07 61.87,9.07 63.48,7.47 63.48,4.8 65.25,3.02 J3.3
N$99
  Bottom 0.203: R17.1 51.03,23.82 51.56,23.82 52.63,22.76 56.72,22.76 60.45,26.49 X1.11
SCL  (via drill 0.3)
  Top 0.203: v23.29,19.38 23.82,19.91 | 23.82,19.91 24,20.09 25.6,20.09 26.49,20.98 v26.85,20.98 30.58,24.71 v40.01,24.71 | v49.07,50.49 49.07,48.72 47.65,47.3 v47.65,33.6 | v56.19,14.05 27.74,14.05 24.18,17.6 20.8,17.6 19.91,18.49 19.91,19.74 21.16,20.98 22.76,20.98 23.82,19.91
  Bottom 0.203: 12.8,21.51 12.8,22.05 U$17.14 | 12.8,21.51 11.38,20.09 9.96,20.09 9.07,19.2 9.07,18.14 IC1.11 | v26.85,20.98 26.85,22.05 U$21.14 | v23.29,19.38 22.94,19.02 22.94,18.14 IC2.11 22.94,17.96 22.94,17.25 22.58,16.89 20.98,16.89 17.96,19.91 14.4,19.91 12.8,21.51 | v40.01,24.71 42.14,26.85 42.67,26.85 U$20.14 42.85,27.03 43.56,27.03 47.65,31.11 v47.65,33.6 | v49.07,50.49 49.07,54.76 U$13.14 | v56.19,14.05 59.92,14.05 62.41,11.56 X1.5
SERDATA  (via drill 0.3)
  Route15 0.203: v7.64,26.67 9.42,26.67 12.8,30.05 13.51,30.05 v13.87,29.69
  Bottom 0.203: v7.64,26.67 6.93,26.67 6.58,27.03 6.58,27.74 U$17.1 | v13.87,29.69 16,27.56 16.18,27.56 17.07,26.67 17.07,21.34 20.45,17.96 21.51,17.96 IC2.9
TEXT1!CE
  Bottom 0.203: IC2.4 24.36,12.09 24.36,10.49 22.58,8.71 19.56,8.71 17.96,7.11 U$3.P$7
TEXT2!CE  (via drill 0.3)
  Top 0.203: v26.85,10.67 v23.65,10.67
  Bottom 0.203: v23.65,10.67 23.65,12.09 IC2.5 | v26.85,10.67 40.18,10.67 43.74,7.11 U$8.P$7
TEXT3!CE  (via drill 0.3)
  Top 0.203: v52.45,3.38 54.05,3.38 54.59,3.91 66.67,3.91 69.7,6.93 U$9.P$7
  Bottom 0.203: v52.45,3.38 52.09,3.73 51.03,3.73 49.96,2.67 20.45,2.67 16.54,6.58 16.54,7.47 18.14,9.07 20.62,9.07 22.94,11.38 22.94,12.09 IC2.6
TEXT4CS  (via drill 0.3)
  Route15 0.203: v17.6,18.85 17.6,22.58 15.11,25.07 15.11,29.34 11.02,33.43 9.78,33.43 9.07,34.14 9.07,37.34 8.89,37.52 8.89,37.69 9.07,37.87 9.07,38.58 8.89,38.76 8.89,40.01 3.73,45.16 3.73,52.45 3.2,52.98 3.2,60.98 v5.33,63.12
  Bottom 0.203: v17.6,18.85 22.23,14.22 22.23,12.27 IC2.7 | v5.33,63.12 5.33,64.54 6.93,66.14 7.82,66.14 U$14.10
VCC  (via drill 0.3, 0.33)
  Route2 0.203: v7,30.75 v7,25
  Route15 0.203: v15,17 15,18 | v29,17 29,18
  Bottom 0.203: 29,15.88 C4.1 | 15,15.88 C5.2 | v4,23.12 C1.1 4.1,24 9,24 9.68,23.32 U$17.19 | v18,23.12 C2.1 18.1,24 22.75,24 | v16,26.88 R5.1 | v30,26.88 R4.1 | v41.88,18 C3.1 41,18.1 41,23 41.67,23.68 U$20.19 | v13.12,50 C7.2 15,50.9 15,54 14,55 U$14.39 | v38.12,30 R3.1 | v46,50.12 R2.1 | v58,53.88 C6.2 57.9,53 53,53 52.33,53.67 U$13.19 | v8.38,19.38 8.38,18.12 IC1.10 | IC1.16 12.25,18 12.9,18 C5.2 | v22.38,19.38 22.38,18.12 IC2.10 | IC2.16 26.25,18 26.9,18 C4.1 | v38.12,72.88 38.12,71.75 U1.3 | v53.62,75.25 53.62,74 C14.+ | C9.2 32.9,34.22 U$8.P$18 | U$3.P$18 6.9,34.22 C8.2 6.9,30.85 v7,30.75 | C10.2 58.9,34.22 U$9.P$18 | C5.2 v15,17 | C4.1 v29,17 | U$21.19 23.68,23.32 23,24 22.75,24 | 22.75,24 v22.5,24.25
  pour Route15: 0,0 80,0 80,80 0,80